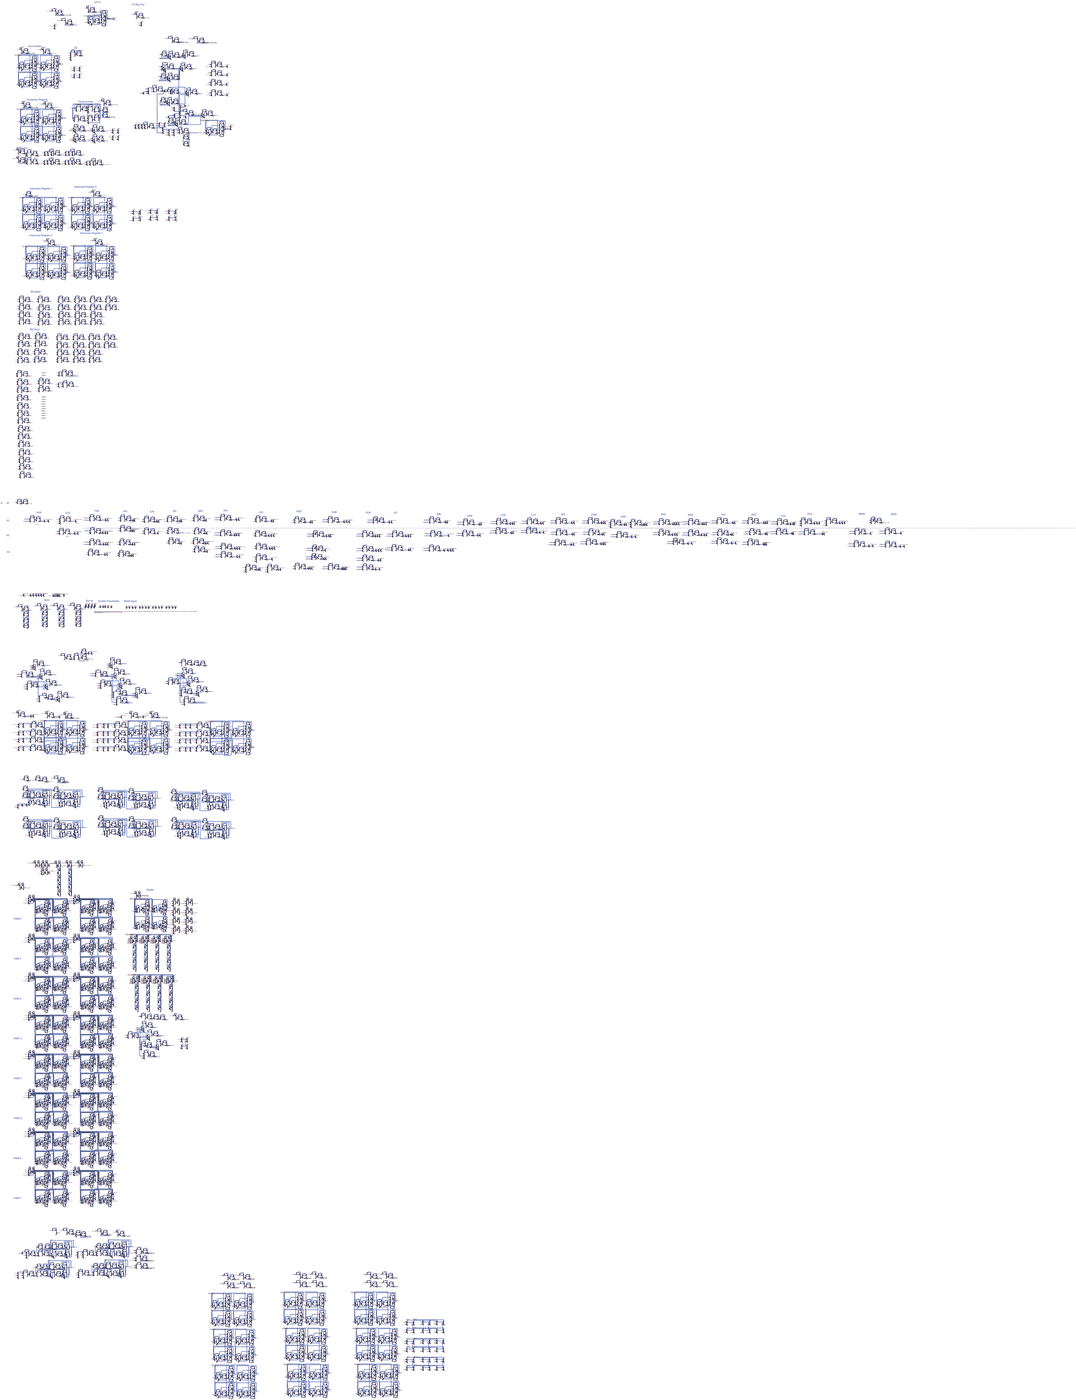
[diagram p0: schematic CPU.asc, whole sheet]
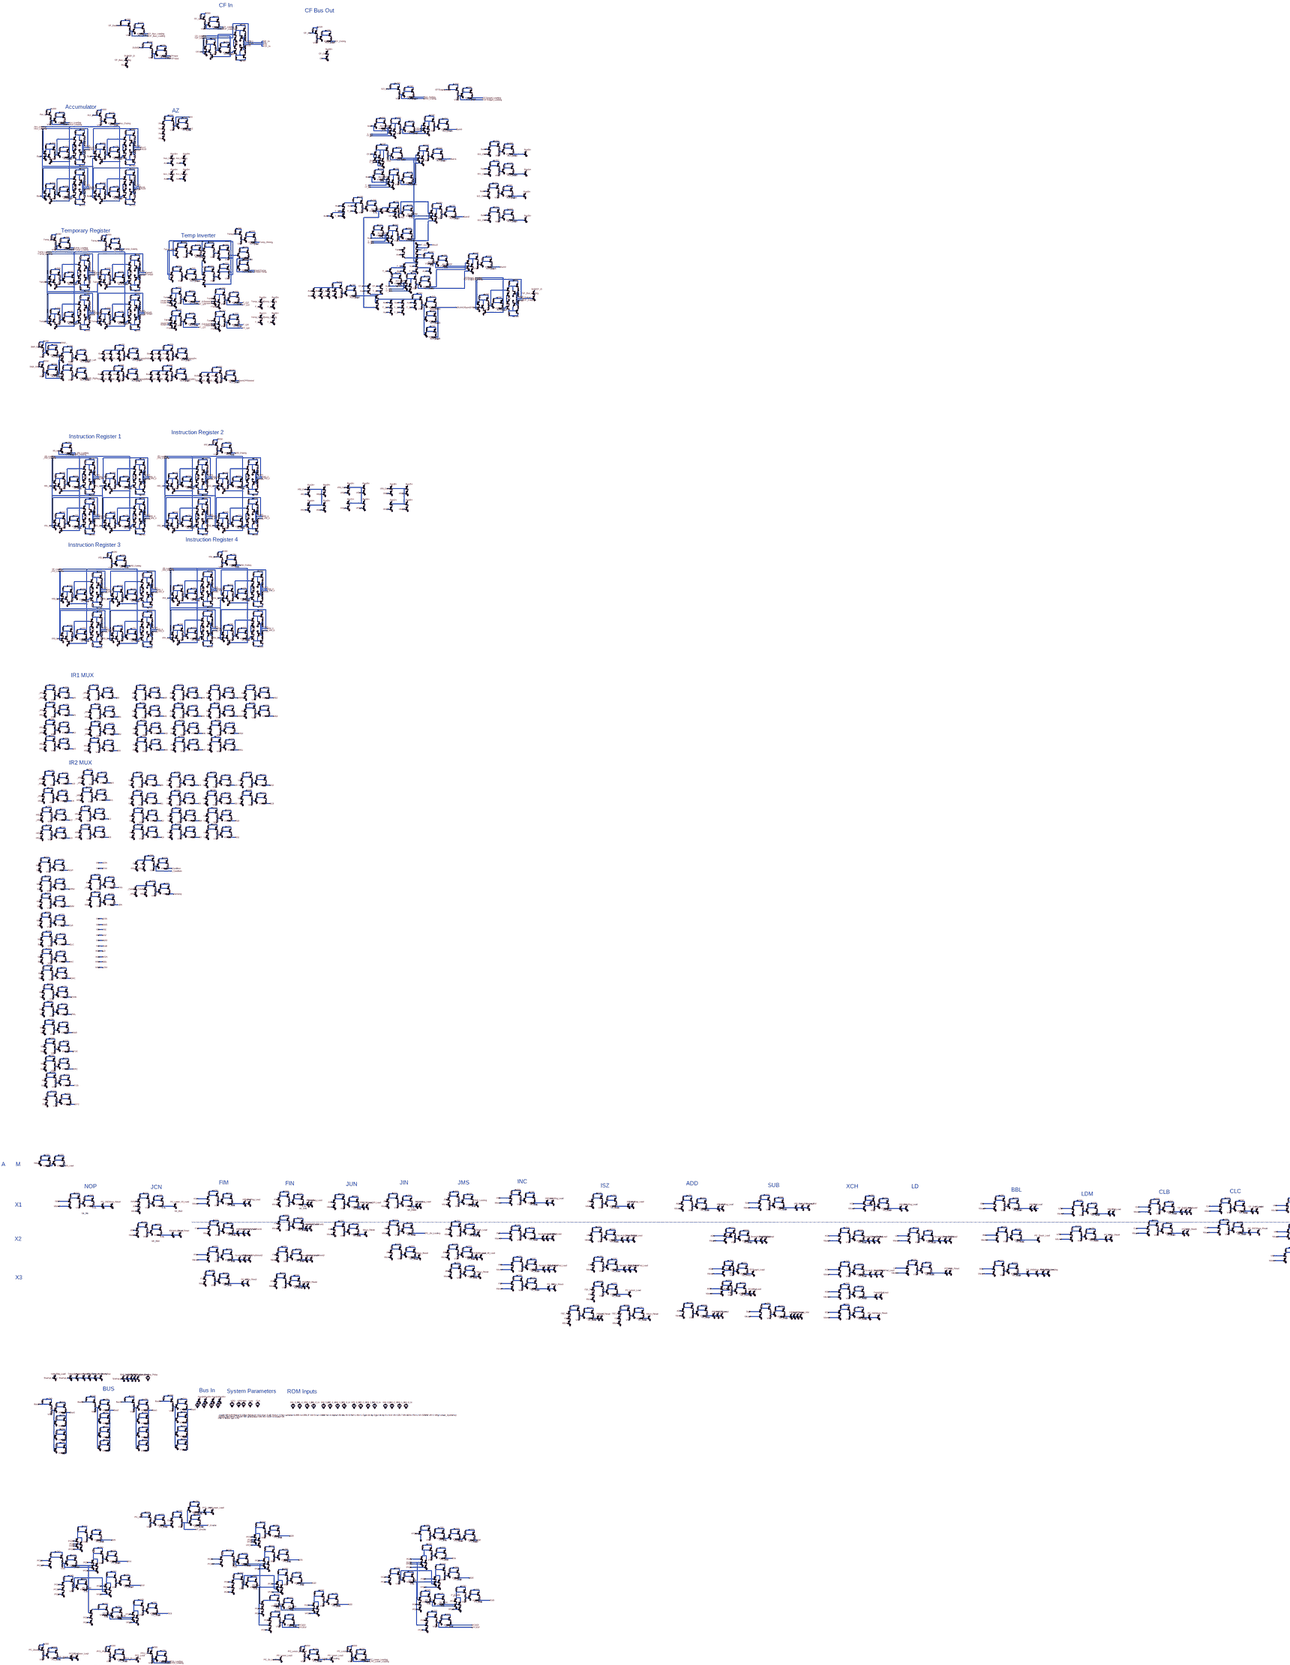
[diagram p1: schematic CPU.asc, part, row 1 of 2, column 1 of 2]
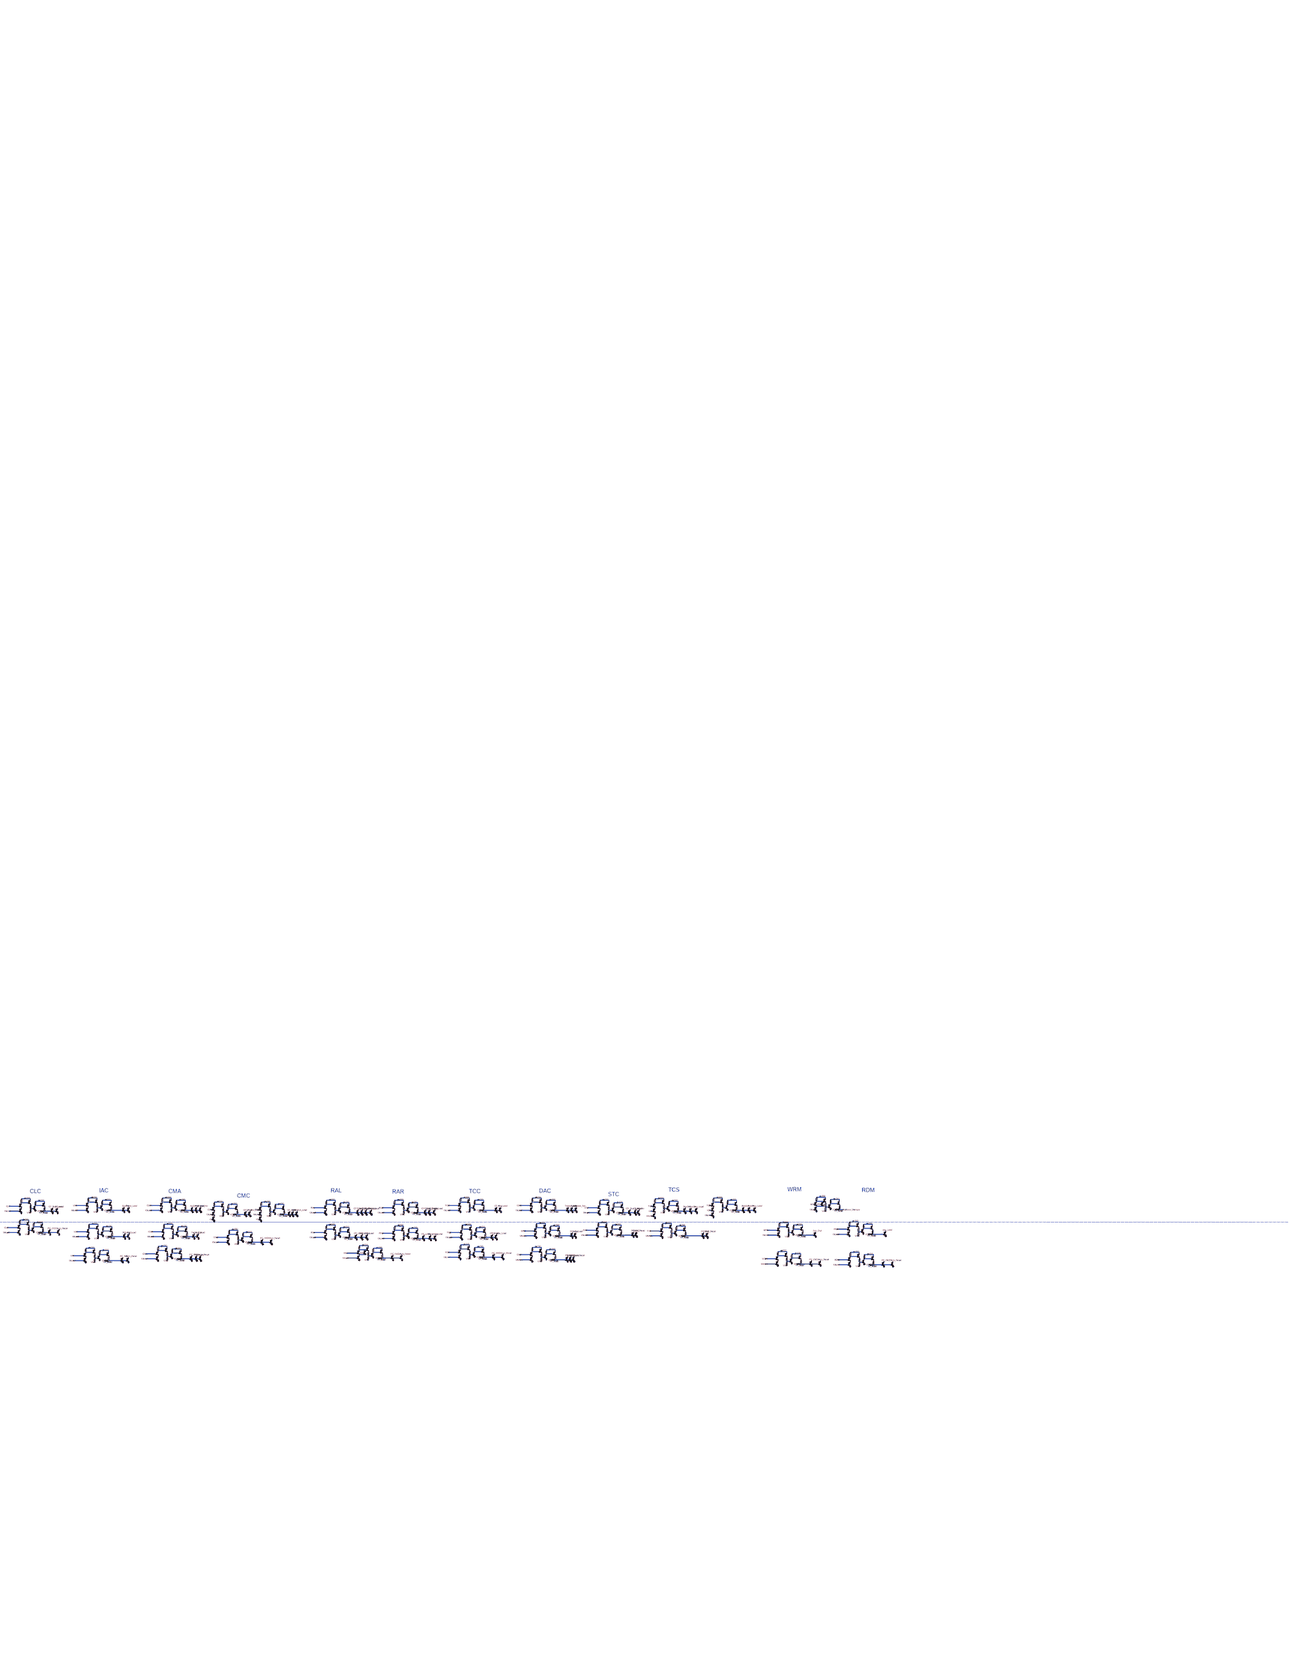
[diagram p2: schematic CPU.asc, part, row 1 of 2, column 2 of 2]
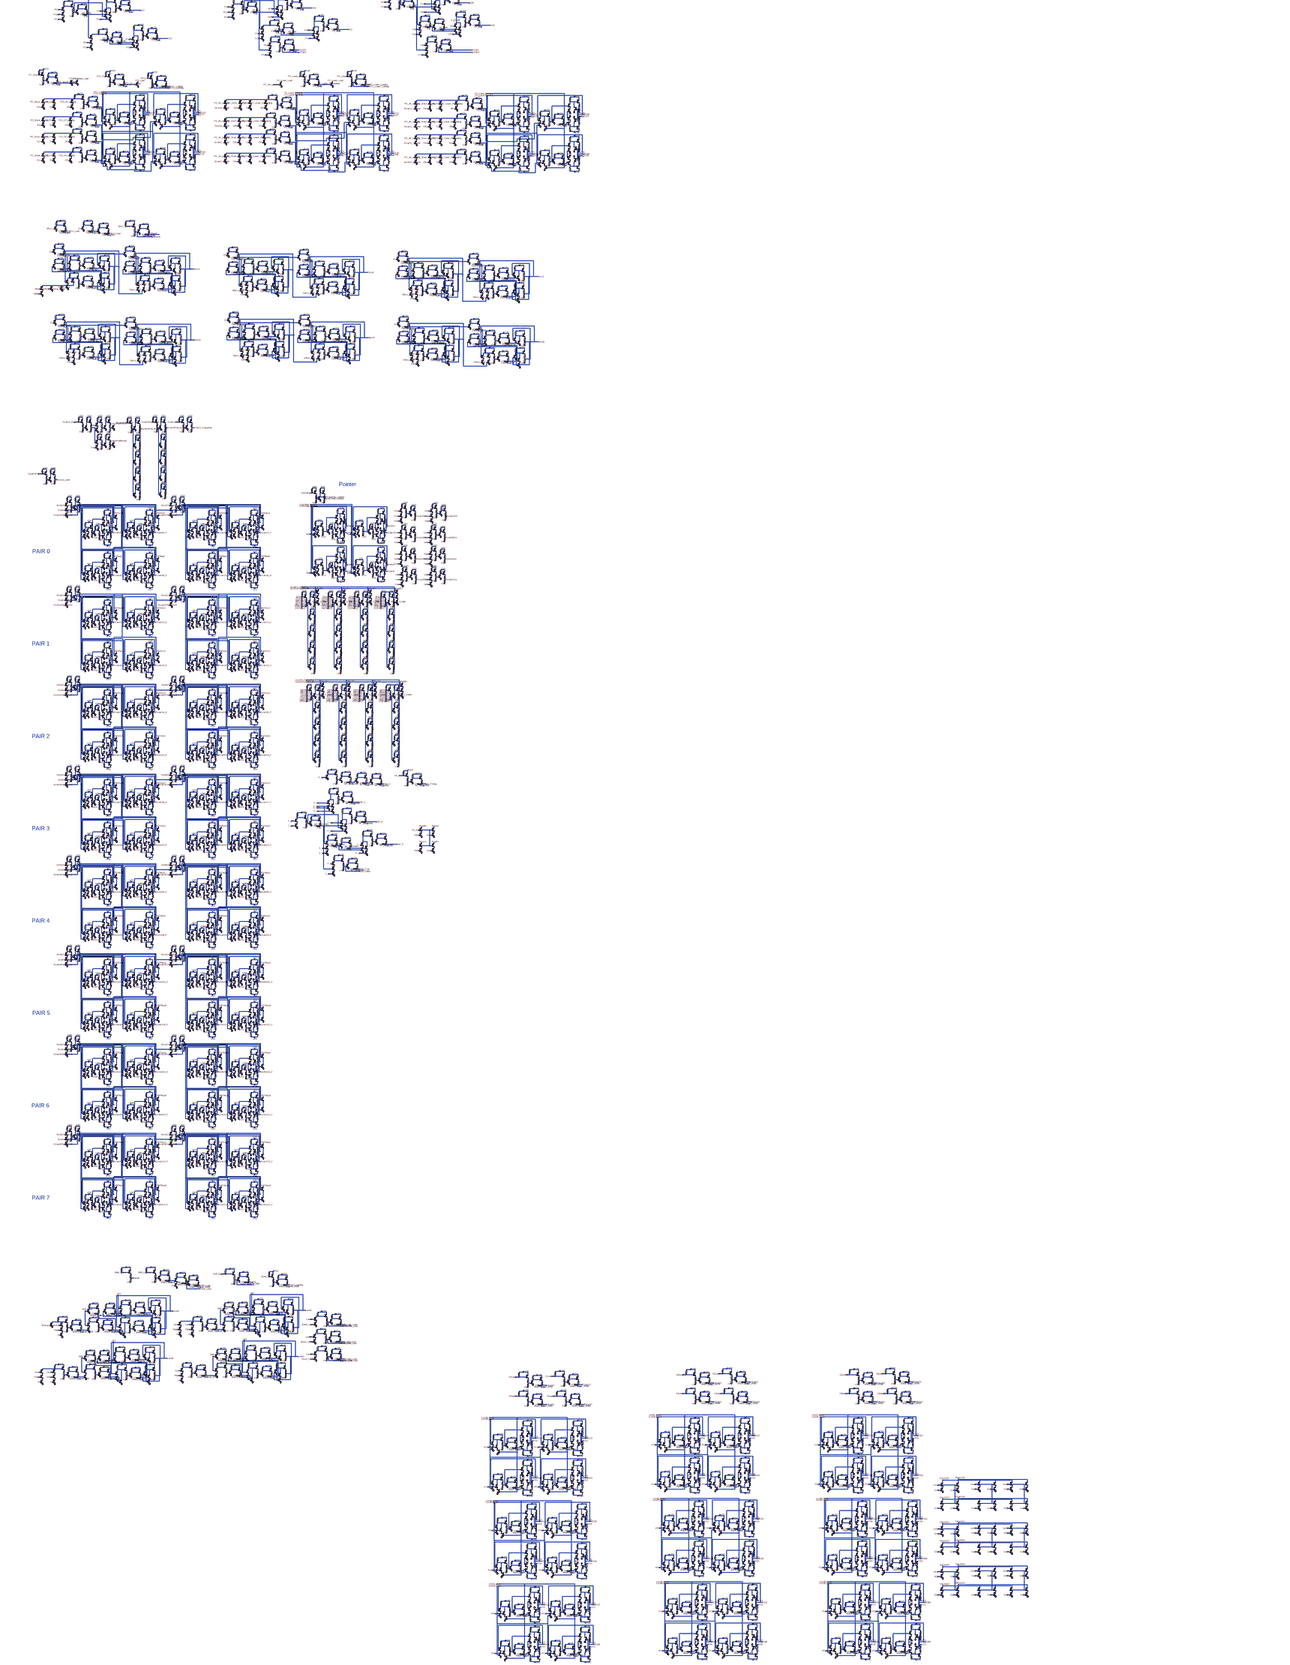
[diagram p3: schematic CPU.asc, part, row 2 of 2, column 1 of 2]
* CPU.asc
J§ALU_J1 N016 !Acc0 P001 DR
R§ALU_R1 VDD N016 100k
J§ALU_J2 VDD N016 P002 DR
R§ALU_R2 P002 AN 1k
R§ALU_R3 AN VSS 4.8k
J§ALU_J3 P001 !Acc1 P003 DR
J§ALU_J4 N019 AN 0 DR
R§ALU_R4 VDD N019 50k
J§ALU_J5 VDD N019 P004 DR
R§ALU_R5 P004 AZ 1k
R§ALU_R6 AZ VSS 4.53k
J§ALU_J6 P003 !Acc2 P005 DR
J§ALU_J7 P005 !Acc3 0 DR
J§ALU_J8 P006 T_Q3 0 DR
J§ALU_J9 Bus3In Temp_Outing P006 DR
J§ALU_J10 P007 T_Q2 0 DR
J§ALU_J11 Bus2In Temp_Outing P007 DR
J§ALU_J12 P008 T_Q1 0 DR
J§ALU_J13 Bus1In Temp_Outing P008 DR
J§ALU_J14 P009 T_Q0 0 DR
J§ALU_J15 Bus0In Temp_Outing P009 DR
R§ALU_R7 VDD Temp_INV 100k
J§ALU_J16 VDD Temp_INV P010 DR
R§ALU_R8 P010 N102 1k
R§ALU_R9 N102 VSS 4.8k
J§ALU_J17 N101 N102 0 DR
R§ALU_R10 VDD N101 50k
J§ALU_J18 VDD N101 P011 DR
R§ALU_R11 P011 Temp_INVing 1k
R§ALU_R12 Temp_INVing VSS 4.5k
J§ALU_J19 N157 Temp3 P012 DR
R§ALU_R13 VDD N157 100k
J§ALU_J20 VDD N157 P013 DR
R§ALU_R14 P013 !T_Q3 1k
R§ALU_R15 !T_Q3 VSS 4.8k
J§ALU_J21 N157 InvertTemp P014 DR
J§ALU_J22 N161 !T_Q3 0 DR
R§ALU_R16 VDD N161 50k
J§ALU_J23 VDD N161 P015 DR
R§ALU_R17 P015 T_Q3 1k
R§ALU_R18 T_Q3 VSS 4.5k
J§ALU_J24 P012 !InvertTemp 0 DR
J§ALU_J25 P014 !Temp3 0 DR
J§ALU_J26 N159 Temp2 P016 DR
R§ALU_R19 VDD N159 100k
J§ALU_J27 VDD N159 P017 DR
R§ALU_R20 P017 !T_Q2 1k
R§ALU_R21 !T_Q2 VSS 4.8k
J§ALU_J28 N159 InvertTemp P018 DR
J§ALU_J29 N163 !T_Q2 0 DR
R§ALU_R22 VDD N163 50k
J§ALU_J30 VDD N163 P019 DR
R§ALU_R23 P019 T_Q2 1k
R§ALU_R24 T_Q2 VSS 4.5k
J§ALU_J31 P016 !InvertTemp 0 DR
J§ALU_J32 P018 !Temp2 0 DR
J§ALU_J33 N177 Temp1 P020 DR
R§ALU_R25 VDD N177 100k
J§ALU_J34 VDD N177 P021 DR
R§ALU_R26 P021 !T_Q1 1k
R§ALU_R27 !T_Q1 VSS 4.8k
J§ALU_J35 N177 InvertTemp P022 DR
J§ALU_J36 N182 !T_Q1 0 DR
R§ALU_R28 VDD N182 50k
J§ALU_J37 VDD N182 P023 DR
R§ALU_R29 P023 T_Q1 1k
R§ALU_R30 T_Q1 VSS 4.5k
J§ALU_J38 P020 !InvertTemp 0 DR
J§ALU_J39 P022 !Temp1 0 DR
J§ALU_J40 N181 Temp0 P024 DR
R§ALU_R31 VDD N181 100k
J§ALU_J41 VDD N181 P025 DR
R§ALU_R32 P025 !T_Q0 1k
R§ALU_R33 !T_Q0 VSS 4.8k
J§ALU_J42 N181 InvertTemp P026 DR
J§ALU_J43 N183 !T_Q0 0 DR
R§ALU_R34 VDD N183 50k
J§ALU_J44 VDD N183 P027 DR
R§ALU_R35 P027 T_Q0 1k
R§ALU_R36 T_Q0 VSS 4.5k
J§ALU_J45 P024 !InvertTemp 0 DR
J§ALU_J46 P026 !Temp0 0 DR
R§ALU_R37 VDD Acc_Load 100k
J§ALU_J47 VDD Acc_Load P028 DR
R§ALU_R38 P028 !Acc_Loading 1k
R§ALU_R39 !Acc_Loading VSS 4.8k
J§ALU_J48 N014 !Acc_Loading 0 DR
R§ALU_R40 VDD N014 50k
J§ALU_J49 VDD N014 P029 DR
R§ALU_R41 P029 Acc_Loading 1k
R§ALU_R42 Acc_Loading VSS 4.5k
R§ALU_R43 VDD Acc_Out 100k
J§ALU_J50 VDD Acc_Out P030 DR
R§ALU_R44 P030 N017 1k
R§ALU_R45 N017 VSS 4.8k
J§ALU_J51 N015 N017 0 DR
R§ALU_R46 VDD N015 50k
J§ALU_J52 VDD N015 P031 DR
R§ALU_R47 P031 Acc_Outing 1k
R§ALU_R48 Acc_Outing VSS 4.5k
J§ALU_J53 N028 N030 P032 DR
R§ALU_R49 VDD N028 100k
J§ALU_J54 VDD N028 P033 DR
R§ALU_R50 P033 Acc3 1k
R§ALU_R51 Acc3 VSS 4.8k
J§ALU_J55 N028 !Acc3 0 DR
J§ALU_J56 N051 N045 P034 DR
R§ALU_R52 VDD N051 100k
J§ALU_J57 VDD N051 P035 DR
R§ALU_R53 P035 !Acc3 1k
R§ALU_R54 !Acc3 VSS 4.8k
J§ALU_J58 N051 Acc3 0 DR
J§ALU_J59 P032 CLK 0 DR
J§ALU_J60 P034 CLK 0 DR
J§ALU_J61 N034 Acc3 P036 DR
R§ALU_R55 VDD N034 100k
J§ALU_J62 VDD N034 P037 DR
R§ALU_R56 P037 N030 1k
R§ALU_R57 N030 VSS 4.8k
J§ALU_J63 N034 Bus3 P038 DR
J§ALU_J64 N038 N030 0 DR
R§ALU_R58 VDD N038 50k
J§ALU_J65 VDD N038 P039 DR
R§ALU_R59 P039 N045 1k
R§ALU_R60 N045 VSS 4.5k
J§ALU_J66 P036 !Acc_Loading 0 DR
J§ALU_J67 P038 Acc_Loading 0 DR
J§ALU_J68 N029 N031 P040 DR
R§ALU_R61 VDD N029 100k
J§ALU_J69 VDD N029 P041 DR
R§ALU_R62 P041 Acc2 1k
R§ALU_R63 Acc2 VSS 4.8k
J§ALU_J70 N029 !Acc2 0 DR
J§ALU_J71 N052 N046 P042 DR
R§ALU_R64 VDD N052 100k
J§ALU_J72 VDD N052 P043 DR
R§ALU_R65 P043 !Acc2 1k
R§ALU_R66 !Acc2 VSS 4.8k
J§ALU_J73 N052 Acc2 0 DR
J§ALU_J74 P040 CLK 0 DR
J§ALU_J75 P042 CLK 0 DR
J§ALU_J76 N035 Acc2 P044 DR
R§ALU_R67 VDD N035 100k
J§ALU_J77 VDD N035 P045 DR
R§ALU_R68 P045 N031 1k
R§ALU_R69 N031 VSS 4.8k
J§ALU_J78 N035 Bus2 P046 DR
J§ALU_J79 N039 N031 0 DR
R§ALU_R70 VDD N039 50k
J§ALU_J80 VDD N039 P047 DR
R§ALU_R71 P047 N046 1k
R§ALU_R72 N046 VSS 4.5k
J§ALU_J81 P044 !Acc_Loading 0 DR
J§ALU_J82 P046 Acc_Loading 0 DR
J§ALU_J83 N059 N063 P048 DR
R§ALU_R73 VDD N059 100k
J§ALU_J84 VDD N059 P049 DR
R§ALU_R74 P049 Acc1 1k
R§ALU_R75 Acc1 VSS 4.8k
J§ALU_J85 N059 !Acc1 0 DR
J§ALU_J86 N076 N073 P050 DR
R§ALU_R76 VDD N076 100k
J§ALU_J87 VDD N076 P051 DR
R§ALU_R77 P051 !Acc1 1k
R§ALU_R78 !Acc1 VSS 4.8k
J§ALU_J88 N076 Acc1 0 DR
J§ALU_J89 P048 CLK 0 DR
J§ALU_J90 P050 CLK 0 DR
J§ALU_J91 N067 Acc1 P052 DR
R§ALU_R79 VDD N067 100k
J§ALU_J92 VDD N067 P053 DR
R§ALU_R80 P053 N063 1k
R§ALU_R81 N063 VSS 4.8k
J§ALU_J93 N067 Bus1 P054 DR
J§ALU_J94 N070 N063 0 DR
R§ALU_R82 VDD N070 50k
J§ALU_J95 VDD N070 P055 DR
R§ALU_R83 P055 N073 1k
R§ALU_R84 N073 VSS 4.5k
J§ALU_J96 P052 !Acc_Loading 0 DR
J§ALU_J97 P054 Acc_Loading 0 DR
J§ALU_J98 N060 N064 P056 DR
R§ALU_R85 VDD N060 100k
J§ALU_J99 VDD N060 P057 DR
R§ALU_R86 P057 Acc0 1k
R§ALU_R87 Acc0 VSS 4.8k
J§ALU_J100 N060 !Acc0 0 DR
J§ALU_J101 N077 N074 P058 DR
R§ALU_R88 VDD N077 100k
J§ALU_J102 VDD N077 P059 DR
R§ALU_R89 P059 !Acc0 1k
R§ALU_R90 !Acc0 VSS 4.8k
J§ALU_J103 N077 Acc0 0 DR
J§ALU_J104 P056 CLK 0 DR
J§ALU_J105 P058 CLK 0 DR
J§ALU_J106 N068 Acc0 P060 DR
R§ALU_R91 VDD N068 100k
J§ALU_J107 VDD N068 P061 DR
R§ALU_R92 P061 N064 1k
R§ALU_R93 N064 VSS 4.8k
J§ALU_J108 N068 Bus0 P062 DR
J§ALU_J109 N071 N064 0 DR
R§ALU_R94 VDD N071 50k
J§ALU_J110 VDD N071 P063 DR
R§ALU_R95 P063 N074 1k
R§ALU_R96 N074 VSS 4.5k
J§ALU_J111 P060 !Acc_Loading 0 DR
J§ALU_J112 P062 Acc_Loading 0 DR
R§ALU_R97 VDD CF_Load 100k
J§ALU_J113 VDD CF_Load P064 DR
R§ALU_R98 P064 !CF_Loading 1k
R§ALU_R99 !CF_Loading VSS 4.8k
J§ALU_J114 N001 !CF_Loading 0 DR
R§ALU_R100 VDD N001 50k
J§ALU_J115 VDD N001 P065 DR
R§ALU_R101 P065 CF_Loading 1k
R§ALU_R102 CF_Loading VSS 4.5k
R§ALU_R103 VDD CF_Out 100k
J§ALU_J116 VDD CF_Out P066 DR
R§ALU_R104 P066 N006 1k
R§ALU_R105 N006 VSS 4.8k
J§ALU_J117 N005 N006 0 DR
R§ALU_R106 VDD N005 50k
J§ALU_J118 VDD N005 P067 DR
R§ALU_R107 P067 CF_Outing 1k
R§ALU_R108 CF_Outing VSS 4.5k
J§ALU_J119 N003 N004 P068 DR
R§ALU_R109 VDD N003 100k
J§ALU_J120 VDD N003 P069 DR
R§ALU_R110 P069 CF0 1k
R§ALU_R111 CF0 VSS 4.8k
J§ALU_J121 N003 !CF 0 DR
J§ALU_J122 N011 N010 P070 DR
R§ALU_R112 VDD N011 100k
J§ALU_J123 VDD N011 P071 DR
R§ALU_R113 P071 !CF 1k
R§ALU_R114 !CF VSS 4.8k
J§ALU_J124 N011 CF0 0 DR
J§ALU_J125 P068 CLK 0 DR
J§ALU_J126 P070 CLK 0 DR
J§ALU_J127 N007 CF0 P072 DR
R§ALU_R115 VDD N007 100k
J§ALU_J128 VDD N007 P073 DR
R§ALU_R116 P073 N004 1k
R§ALU_R117 N004 VSS 4.8k
J§ALU_J129 N007 CFInput P074 DR
J§ALU_J130 N008 N004 0 DR
R§ALU_R118 VDD N008 50k
J§ALU_J131 VDD N008 P075 DR
R§ALU_R119 P075 N010 1k
R§ALU_R120 N010 VSS 4.5k
J§ALU_J132 P072 !CF_Loading 0 DR
J§ALU_J133 P074 CF_Loading 0 DR
J§ALU_J134 P076 CF0 0 DR
J§ALU_J135 Bus0In CF_Outing P076 DR
R§ALU_R121 VDD Temp_Load 100k
J§ALU_J136 VDD Temp_Load P077 DR
R§ALU_R122 P077 !Temp_Loading 1k
R§ALU_R123 !Temp_Loading VSS 4.8k
J§ALU_J137 N105 !Temp_Loading 0 DR
R§ALU_R124 VDD N105 50k
J§ALU_J138 VDD N105 P078 DR
R§ALU_R125 P078 Temp_Loading 1k
R§ALU_R126 Temp_Loading VSS 4.5k
R§ALU_R127 VDD Temp_Out 100k
J§ALU_J139 VDD Temp_Out P079 DR
R§ALU_R128 P079 N107 1k
R§ALU_R129 N107 VSS 4.8k
J§ALU_J140 N106 N107 0 DR
R§ALU_R130 VDD N106 50k
J§ALU_J141 VDD N106 P080 DR
R§ALU_R131 P080 Temp_Outing 1k
R§ALU_R132 Temp_Outing VSS 4.5k
J§ALU_J142 N119 N126 P081 DR
R§ALU_R133 VDD N119 100k
J§ALU_J143 VDD N119 P082 DR
R§ALU_R134 P082 Temp3 1k
R§ALU_R135 Temp3 VSS 4.8k
J§ALU_J144 N119 !Temp3 0 DR
J§ALU_J145 N151 N147 P083 DR
R§ALU_R136 VDD N151 100k
J§ALU_J146 VDD N151 P084 DR
R§ALU_R137 P084 !Temp3 1k
R§ALU_R138 !Temp3 VSS 4.8k
J§ALU_J147 N151 Temp3 0 DR
J§ALU_J148 P081 CLK 0 DR
J§ALU_J149 P083 CLK 0 DR
J§ALU_J150 N138 Temp3 P085 DR
R§ALU_R139 VDD N138 100k
J§ALU_J151 VDD N138 P086 DR
R§ALU_R140 P086 N126 1k
R§ALU_R141 N126 VSS 4.8k
J§ALU_J152 N138 Temp3In P087 DR
J§ALU_J153 N140 N126 0 DR
R§ALU_R142 VDD N140 50k
J§ALU_J154 VDD N140 P088 DR
R§ALU_R143 P088 N147 1k
R§ALU_R144 N147 VSS 4.5k
J§ALU_J155 P085 !Temp_Loading 0 DR
J§ALU_J156 P087 Temp_Loading 0 DR
J§ALU_J157 N120 N127 P089 DR
R§ALU_R145 VDD N120 100k
J§ALU_J158 VDD N120 P090 DR
R§ALU_R146 P090 Temp2 1k
R§ALU_R147 Temp2 VSS 4.8k
J§ALU_J159 N120 !Temp2 0 DR
J§ALU_J160 N152 N148 P091 DR
R§ALU_R148 VDD N152 100k
J§ALU_J161 VDD N152 P092 DR
R§ALU_R149 P092 !Temp2 1k
R§ALU_R150 !Temp2 VSS 4.8k
J§ALU_J162 N152 Temp2 0 DR
J§ALU_J163 P089 CLK 0 DR
J§ALU_J164 P091 CLK 0 DR
J§ALU_J165 N139 Temp2 P093 DR
R§ALU_R151 VDD N139 100k
J§ALU_J166 VDD N139 P094 DR
R§ALU_R152 P094 N127 1k
R§ALU_R153 N127 VSS 4.8k
J§ALU_J167 N139 Temp2In P095 DR
J§ALU_J168 N141 N127 0 DR
R§ALU_R154 VDD N141 50k
J§ALU_J169 VDD N141 P096 DR
R§ALU_R155 P096 N148 1k
R§ALU_R156 N148 VSS 4.5k
J§ALU_J170 P093 !Temp_Loading 0 DR
J§ALU_J171 P095 Temp_Loading 0 DR
J§ALU_J172 N165 N170 P097 DR
R§ALU_R157 VDD N165 100k
J§ALU_J173 VDD N165 P098 DR
R§ALU_R158 P098 Temp1 1k
R§ALU_R159 Temp1 VSS 4.8k
J§ALU_J174 N165 !Temp1 0 DR
J§ALU_J175 N186 N184 P099 DR
R§ALU_R160 VDD N186 100k
J§ALU_J176 VDD N186 P100 DR
R§ALU_R161 P100 !Temp1 1k
R§ALU_R162 !Temp1 VSS 4.8k
J§ALU_J177 N186 Temp1 0 DR
J§ALU_J178 P097 CLK 0 DR
J§ALU_J179 P099 CLK 0 DR
J§ALU_J180 N175 Temp1 P101 DR
R§ALU_R163 VDD N175 100k
J§ALU_J181 VDD N175 P102 DR
R§ALU_R164 P102 N170 1k
R§ALU_R165 N170 VSS 4.8k
J§ALU_J182 N175 Temp1In P103 DR
J§ALU_J183 N179 N170 0 DR
R§ALU_R166 VDD N179 50k
J§ALU_J184 VDD N179 P104 DR
R§ALU_R167 P104 N184 1k
R§ALU_R168 N184 VSS 4.5k
J§ALU_J185 P101 !Temp_Loading 0 DR
J§ALU_J186 P103 Temp_Loading 0 DR
J§ALU_J187 N166 N171 P105 DR
R§ALU_R169 VDD N166 100k
J§ALU_J188 VDD N166 P106 DR
R§ALU_R170 P106 Temp0 1k
R§ALU_R171 Temp0 VSS 4.8k
J§ALU_J189 N166 !Temp0 0 DR
J§ALU_J190 N187 N185 P107 DR
R§ALU_R172 VDD N187 100k
J§ALU_J191 VDD N187 P108 DR
R§ALU_R173 P108 !Temp0 1k
R§ALU_R174 !Temp0 VSS 4.8k
J§ALU_J192 N187 Temp0 0 DR
J§ALU_J193 P105 CLK 0 DR
J§ALU_J194 P107 CLK 0 DR
J§ALU_J195 N176 Temp0 P109 DR
R§ALU_R175 VDD N176 100k
J§ALU_J196 VDD N176 P110 DR
R§ALU_R176 P110 N171 1k
R§ALU_R177 N171 VSS 4.8k
J§ALU_J197 N176 Temp0In P111 DR
J§ALU_J198 N180 N171 0 DR
R§ALU_R178 VDD N180 50k
J§ALU_J199 VDD N180 P112 DR
R§ALU_R179 P112 N185 1k
R§ALU_R180 N185 VSS 4.5k
J§ALU_J200 P109 !Temp_Loading 0 DR
J§ALU_J201 P111 Temp_Loading 0 DR
J§ALU_J202 N081 Acc1 N089 DR
J§ALU_J203 N020 Acc0 0 DR
R§ALU_R181 VDD N020 50k
J§ALU_J204 VDD N020 P113 DR
R§ALU_R182 P113 N026 1k
R§ALU_R183 N026 VSS 4.5k
J§ALU_J205 N021 T_Q0 P114 DR
R§ALU_R184 VDD N021 100k
J§ALU_J206 VDD N021 P115 DR
R§ALU_R185 P115 N027 1k
R§ALU_R186 N027 VSS 4.8k
J§ALU_J207 N021 Acc0 P116 DR
J§ALU_J208 N024 N027 0 DR
R§ALU_R187 VDD N024 50k
J§ALU_J209 VDD N024 P117 DR
R§ALU_R188 P117 N023 1k
R§ALU_R189 N023 VSS 4.5k
J§ALU_J210 P114 N026 0 DR
J§ALU_J211 P116 !T_Q0 0 DR
J§ALU_J212 N018 N023 P118 DR
R§ALU_R190 VDD N018 100k
J§ALU_J213 VDD N018 P119 DR
R§ALU_R191 P119 N025 1k
R§ALU_R192 N025 VSS 4.8k
J§ALU_J214 N018 CF0 P120 DR
J§ALU_J215 N022 N025 0 DR
R§ALU_R193 VDD N022 50k
J§ALU_J216 VDD N022 P121 DR
R§ALU_R194 P121 Sum0 1k
R§ALU_R195 Sum0 VSS 4.5k
J§ALU_J217 P118 !CF 0 DR
J§ALU_J218 P120 N027 0 DR
J§ALU_J219 N036 CF0 N048 DR
R§ALU_R196 VDD N036 100k
J§ALU_J220 VDD N036 P122 DR
R§ALU_R197 P122 N047 1k
R§ALU_R198 N047 VSS 4.8k
J§ALU_J221 N036 CF0 P123 DR
J§ALU_J222 N041 N047 0 DR
R§ALU_R199 VDD N041 50k
J§ALU_J223 VDD N041 P124 DR
R§ALU_R200 P124 N050 1k
R§ALU_R201 N050 VSS 4.5k
J§ALU_J224 N048 Acc0 0 DR
J§ALU_J225 P123 T_Q0 0 DR
J§ALU_J226 N036 Acc0 P125 DR
J§ALU_J227 P125 T_Q0 0 DR
J§ALU_J228 N037 N044 P126 DR
R§ALU_R202 VDD N037 100k
J§ALU_J229 VDD N037 P127 DR
R§ALU_R203 P127 N049 1k
R§ALU_R204 N049 VSS 4.8k
J§ALU_J230 N037 N050 P128 DR
J§ALU_J231 N042 N049 0 DR
R§ALU_R205 VDD N042 50k
J§ALU_J232 VDD N042 P129 DR
R§ALU_R206 P129 Sum1 1k
R§ALU_R207 Sum1 VSS 4.5k
J§ALU_J233 P126 N047 0 DR
J§ALU_J234 P128 N053 0 DR
J§ALU_J235 N057 Acc1 0 DR
R§ALU_R208 VDD N057 50k
J§ALU_J236 VDD N057 P130 DR
R§ALU_R209 P130 N065 1k
R§ALU_R210 N065 VSS 4.5k
J§ALU_J237 N061 T_Q1 P131 DR
R§ALU_R211 VDD N061 100k
J§ALU_J238 VDD N061 P132 DR
R§ALU_R212 P132 N053 1k
R§ALU_R213 N053 VSS 4.8k
J§ALU_J239 N061 Acc1 P133 DR
J§ALU_J240 N062 N053 0 DR
R§ALU_R214 VDD N062 50k
J§ALU_J241 VDD N062 P134 DR
R§ALU_R215 P134 N044 1k
R§ALU_R216 N044 VSS 4.5k
J§ALU_J242 P131 N065 0 DR
J§ALU_J243 P133 !T_Q1 0 DR
J§ALU_J244 N081 T_Q1 N089 DR
J§ALU_J245 N083 N090 P135 DR
R§ALU_R217 VDD N083 100k
J§ALU_J246 VDD N083 P136 DR
R§ALU_R218 P136 N091 1k
R§ALU_R219 N091 VSS 4.8k
J§ALU_J247 N083 N093 P137 DR
J§ALU_J248 N086 N091 0 DR
R§ALU_R220 VDD N086 50k
J§ALU_J249 VDD N086 P138 DR
R§ALU_R221 P138 Sum2 1k
R§ALU_R222 Sum2 VSS 4.5k
J§ALU_J250 P135 N078 0 DR
J§ALU_J251 P137 N096 0 DR
J§ALU_J252 N097 Acc2 0 DR
R§ALU_R223 VDD N097 50k
J§ALU_J253 VDD N097 P139 DR
R§ALU_R224 P139 N100 1k
R§ALU_R225 N100 VSS 4.5k
J§ALU_J254 N098 T_Q2 P140 DR
R§ALU_R226 VDD N098 100k
J§ALU_J255 VDD N098 P141 DR
R§ALU_R227 P141 N096 1k
R§ALU_R228 N096 VSS 4.8k
J§ALU_J256 N098 Acc2 P142 DR
J§ALU_J257 N099 N096 0 DR
R§ALU_R229 VDD N099 50k
J§ALU_J258 VDD N099 P143 DR
R§ALU_R230 P143 N090 1k
R§ALU_R231 N090 VSS 4.5k
J§ALU_J259 P140 N100 0 DR
J§ALU_J260 P142 !T_Q2 0 DR
R§ALU_R232 VDD N117 100k
J§ALU_J261 VDD N117 P144 DR
R§ALU_R233 P144 N125 1k
R§ALU_R234 N125 VSS 4.8k
J§ALU_J262 N121 N125 0 DR
R§ALU_R235 VDD N121 50k
J§ALU_J263 VDD N121 P145 DR
R§ALU_R236 P145 N130 1k
R§ALU_R237 N130 VSS 4.5k
J§ALU_J264 N117 Acc2 P146 DR
J§ALU_J265 P146 Temp2 0 DR
J§ALU_J266 N117 Acc1 P147 DR
J§ALU_J267 P147 T_Q1 N110 DR
J§ALU_J268 N110 T_Q2 0 DR
J§ALU_J269 N110 Acc2 0 DR
J§ALU_J270 N132 Acc1 0 DR
J§ALU_J271 N123 T_Q2 N131 DR
J§ALU_J272 N131 Acc1 0 DR
J§ALU_J273 N132 T_Q1 0 DR
J§ALU_J274 N123 Acc2 N132 DR
J§ALU_J275 N131 T_Q1 0 DR
J§ALU_J276 N117 N050 N123 DR
J§ALU_J277 N118 N124 P148 DR
R§ALU_R238 VDD N118 100k
J§ALU_J278 VDD N118 P149 DR
R§ALU_R239 P149 N129 1k
R§ALU_R240 N129 VSS 4.8k
J§ALU_J279 N118 N130 P150 DR
J§ALU_J280 N122 N129 0 DR
R§ALU_R241 VDD N122 50k
J§ALU_J281 VDD N122 P151 DR
R§ALU_R242 P151 Sum3 1k
R§ALU_R243 Sum3 VSS 4.5k
J§ALU_J282 P148 N125 0 DR
J§ALU_J283 P150 N136 0 DR
J§ALU_J284 N144 Acc3 0 DR
R§ALU_R244 VDD N144 50k
J§ALU_J285 VDD N144 P152 DR
R§ALU_R245 P152 N150 1k
R§ALU_R246 N150 VSS 4.5k
J§ALU_J286 N145 T_Q3 P153 DR
R§ALU_R247 VDD N145 100k
J§ALU_J287 VDD N145 P154 DR
R§ALU_R248 P154 N136 1k
R§ALU_R249 N136 VSS 4.8k
J§ALU_J288 N145 Acc3 P155 DR
J§ALU_J289 N149 N136 0 DR
R§ALU_R250 VDD N149 50k
J§ALU_J290 VDD N149 P156 DR
R§ALU_R251 P156 N124 1k
R§ALU_R252 N124 VSS 4.5k
J§ALU_J291 P153 N150 0 DR
J§ALU_J292 P155 !T_Q3 0 DR
R§ALU_R253 VDD N081 100k
J§ALU_J293 VDD N081 P157 DR
R§ALU_R254 P157 N078 1k
R§ALU_R255 N078 VSS 4.8k
J§ALU_J294 N084 N078 0 DR
R§ALU_R256 VDD N084 50k
J§ALU_J295 VDD N084 P158 DR
R§ALU_R257 P158 N093 1k
R§ALU_R258 N093 VSS 4.5k
J§ALU_J296 N079 Acc1 P159 DR
J§ALU_J297 P159 T_Q1 0 DR
J§ALU_J298 N079 Acc0 P160 DR
J§ALU_J299 P160 T_Q0 N088 DR
R§ALU_R259 VDD N079 100k
J§ALU_J300 VDD N079 P161 DR
R§ALU_R260 P161 N082 1k
R§ALU_R261 N082 VSS 4.8k
J§ALU_J301 N080 N082 0 DR
R§ALU_R262 VDD N080 50k
J§ALU_J302 VDD N080 P162 DR
R§ALU_R263 P162 N085 1k
R§ALU_R264 N085 VSS 4.5k
J§ALU_J303 N088 Acc1 0 DR
J§ALU_J304 N088 T_Q1 0 DR
J§ALU_J305 N089 CF0 0 DR
J§ALU_J306 N081 N085 0 DR
J§ALU_J307 N164 N162 P163 DR
J§ALU_J308 P163 N085 0 DR
J§ALU_J309 N160 T_Q1 P164 DR
J§ALU_J310 P164 CF0 0 DR
J§ALU_J311 N160 Acc1 P165 DR
J§ALU_J312 P165 CF0 0 DR
R§ALU_R265 VDD N154 100k
J§ALU_J313 VDD N154 P166 DR
R§ALU_R266 P166 N158 1k
R§ALU_R267 N158 VSS 4.8k
J§ALU_J314 N155 N158 0 DR
R§ALU_R268 VDD N155 50k
J§ALU_J315 VDD N155 P167 DR
R§ALU_R269 P167 N162 1k
R§ALU_R270 N162 VSS 4.5k
J§ALU_J316 N154 Acc3 P168 DR
J§ALU_J317 N154 T_Q3 P169 DR
J§ALU_J318 P168 T_Q2 0 DR
J§ALU_J319 P169 T_Q2 0 DR
J§ALU_J320 N164 Acc3 P170 DR
J§ALU_J321 P170 T_Q3 0 DR
J§ALU_J322 N164 Acc2 P171 DR
J§ALU_J323 P171 T_Q2 P172 DR
J§ALU_J324 P172 T_Q3 0 DR
J§ALU_J325 N164 Acc2 P173 DR
J§ALU_J326 P173 T_Q2 P174 DR
J§ALU_J327 P174 Acc3 0 DR
J§ALU_J328 N164 N162 N160 DR
R§ALU_R271 VDD N164 100k
J§ALU_J329 VDD N164 P175 DR
R§ALU_R272 P175 N172 1k
R§ALU_R273 N172 VSS 4.8k
J§ALU_J330 N168 N172 0 DR
R§ALU_R274 VDD N168 50k
J§ALU_J331 VDD N168 P176 DR
R§ALU_R275 P176 SUMCF 1k
R§ALU_R276 SUMCF VSS 4.5k
J§ALU_J332 N032 Sum0 P177 DR
R§ALU_R277 VDD N032 100k
J§ALU_J333 VDD N032 P178 DR
R§ALU_R278 P178 N040 1k
R§ALU_R279 N040 VSS 4.8k
J§ALU_J334 P177 EO_Outing 0 DR
J§ALU_J335 N033 N040 0 DR
R§ALU_R280 VDD N033 50k
J§ALU_J336 VDD N033 P179 DR
R§ALU_R281 P179 N043 1k
R§ALU_R282 N043 VSS 4.5k
J§ALU_J337 Bus0In N043 0 DR
J§ALU_J338 N054 Sum1 P180 DR
R§ALU_R283 VDD N054 100k
J§ALU_J339 VDD N054 P181 DR
R§ALU_R284 P181 N056 1k
R§ALU_R285 N056 VSS 4.8k
J§ALU_J340 P180 EO_Outing 0 DR
J§ALU_J341 N055 N056 0 DR
R§ALU_R286 VDD N055 50k
J§ALU_J342 VDD N055 P182 DR
R§ALU_R287 P182 N058 1k
R§ALU_R288 N058 VSS 4.5k
J§ALU_J343 Bus1In N058 0 DR
J§ALU_J344 N066 Sum2 P183 DR
R§ALU_R289 VDD N066 100k
J§ALU_J345 VDD N066 P184 DR
R§ALU_R290 P184 N072 1k
R§ALU_R291 N072 VSS 4.8k
J§ALU_J346 P183 EO_Outing 0 DR
J§ALU_J347 N069 N072 0 DR
R§ALU_R292 VDD N069 50k
J§ALU_J348 VDD N069 P185 DR
R§ALU_R293 P185 N075 1k
R§ALU_R294 N075 VSS 4.5k
J§ALU_J349 Bus2In N075 0 DR
J§ALU_J350 N087 Sum3 P186 DR
R§ALU_R295 VDD N087 100k
J§ALU_J351 VDD N087 P187 DR
R§ALU_R296 P187 N094 1k
R§ALU_R297 N094 VSS 4.8k
J§ALU_J352 P186 EO_Outing 0 DR
J§ALU_J353 N092 N094 0 DR
R§ALU_R298 VDD N092 50k
J§ALU_J354 VDD N092 P188 DR
R§ALU_R299 P188 N095 1k
R§ALU_R300 N095 VSS 4.5k
J§ALU_J355 Bus3In N095 0 DR
J§ALU_J356 N153 N156 P189 DR
R§ALU_R301 VDD N153 100k
J§ALU_J357 VDD N153 P190 DR
R§ALU_R302 P190 CF_Output 1k
R§ALU_R303 CF_Output VSS 4.8k
J§ALU_J358 N153 !CF_Output 0 DR
J§ALU_J359 N174 N173 P191 DR
R§ALU_R304 VDD N174 100k
J§ALU_J360 VDD N174 P192 DR
R§ALU_R305 P192 !CF_Output 1k
R§ALU_R306 !CF_Output VSS 4.8k
J§ALU_J361 N174 CF_Output 0 DR
J§ALU_J362 P189 CLK 0 DR
J§ALU_J363 P191 CLK 0 DR
J§ALU_J364 N167 CF_Output P193 DR
R§ALU_R307 VDD N167 100k
J§ALU_J365 VDD N167 P194 DR
R§ALU_R308 P194 N156 1k
R§ALU_R309 N156 VSS 4.8k
J§ALU_J366 N167 SumCFRotated P195 DR
J§ALU_J367 N169 N156 0 DR
R§ALU_R310 VDD N169 50k
J§ALU_J368 VDD N169 P196 DR
R§ALU_R311 P196 N173 1k
R§ALU_R312 N173 VSS 4.5k
J§ALU_J369 P193 !CFStage1_Loading 0 DR
J§ALU_J370 P195 CFStage1_Loading 0 DR
R§ALU_R313 VDD CF_Bus_Load 100k
J§ALU_J371 VDD CF_Bus_Load P197 DR
R§ALU_R314 P197 !CF_Bus_Loading 1k
R§ALU_R315 !CF_Bus_Loading VSS 4.8k
J§ALU_J372 N002 !CF_Bus_Loading 0 DR
R§ALU_R316 VDD N002 50k
J§ALU_J373 VDD N002 P198 DR
R§ALU_R317 P198 CF_Bus_Loading 1k
R§ALU_R318 CF_Bus_Loading VSS 4.5k
J§ALU_J374 P199 CF_Output 0 DR
J§ALU_J375 SUMCF_O !CF_Bus_Loading P199 DR
J§ALU_J376 SUMCF_O CF_Bus_Loading P200 DR
J§ALU_J377 P200 Bus0 0 DR
R§ALU_R319 VDD SUMCF_O 100k
J§ALU_J378 VDD SUMCF_O P201 DR
R§ALU_R320 P201 !CFInput 1k
R§ALU_R321 !CFInput VSS 4.8k
J§ALU_J379 N009 !CFInput 0 DR
R§ALU_R322 VDD N009 50k
J§ALU_J380 VDD N009 P202 DR
R§ALU_R323 P202 CFInput 1k
R§ALU_R324 CFInput VSS 4.5k
J§ALU_J381 P203 Acc3 0 DR
J§ALU_J382 Bus3In Acc_Outing P203 DR
J§ALU_J383 P204 Acc2 0 DR
J§ALU_J384 Bus2In Acc_Outing P204 DR
J§ALU_J385 P205 Acc1 0 DR
J§ALU_J386 Bus1In Acc_Outing P205 DR
J§ALU_J387 P206 Acc0 0 DR
J§ALU_J388 Bus0In Acc_Outing P206 DR
J§ALU_J389 N108 Temp_INVing P207 DR
R§ALU_R325 VDD N108 100k
J§ALU_J390 VDD N108 P208 DR
R§ALU_R326 P208 N114 1k
R§ALU_R327 N114 VSS 4.8k
J§ALU_J391 P207 N104 0 DR
J§ALU_J392 N111 N114 0 DR
R§ALU_R328 VDD N111 50k
J§ALU_J393 VDD N111 P209 DR
R§ALU_R329 P209 N116 1k
R§ALU_R330 N116 VSS 4.5k
J§ALU_J394 N134 Temp_INVing P210 DR
R§ALU_R331 VDD N134 100k
J§ALU_J395 VDD N134 P211 DR
R§ALU_R332 P211 N142 1k
R§ALU_R333 N142 VSS 4.8k
J§ALU_J396 P210 N103 0 DR
J§ALU_J397 N137 N142 0 DR
R§ALU_R334 VDD N137 50k
J§ALU_J398 VDD N137 P212 DR
R§ALU_R335 P212 N146 1k
R§ALU_R336 N146 VSS 4.5k
J§ALU_J399 N109 N104 P213 DR
R§ALU_R337 VDD N109 100k
J§ALU_J400 VDD N109 P214 DR
R§ALU_R338 P214 N115 1k
R§ALU_R339 N115 VSS 4.8k
J§ALU_J401 P213 N116 P215 DR
J§ALU_J402 N135 CLK P216 DR
R§ALU_R340 VDD N135 100k
J§ALU_J403 VDD N135 P217 DR
R§ALU_R341 P217 N143 1k
R§ALU_R342 N143 VSS 4.8k
J§ALU_J404 P216 N146 P218 DR
J§ALU_J405 N112 N115 P219 DR
R§ALU_R343 VDD N112 100k
J§ALU_J406 VDD N112 P220 DR
R§ALU_R344 P220 N103 1k
R§ALU_R345 N103 VSS 4.8k
J§ALU_J407 P219 N104 0 DR
J§ALU_J408 N133 N103 P221 DR
R§ALU_R346 VDD N133 100k
J§ALU_J409 VDD N133 P222 DR
R§ALU_R347 P222 N104 1k
R§ALU_R348 N104 VSS 4.8k
J§ALU_J410 P221 N143 0 DR
J§ALU_J411 P215 CLK 0 DR
J§ALU_J412 P218 N103 0 DR
J§ALU_J413 N113 N103 0 DR
R§ALU_R349 VDD N113 50k
J§ALU_J414 VDD N113 P223 DR
R§ALU_R350 P223 !InvertTemp 1k
R§ALU_R351 !InvertTemp VSS 4.5k
J§ALU_J415 N128 !InvertTemp 0 DR
R§ALU_R352 VDD N128 50k
J§ALU_J416 VDD N128 P224 DR
R§ALU_R353 P224 InvertTemp 1k
R§ALU_R354 InvertTemp VSS 4.5k
R§ALU_R355 VDD EO_Out 100k
J§ALU_J417 VDD EO_Out P225 DR
R§ALU_R356 P225 !EO_Outing 1k
R§ALU_R357 !EO_Outing VSS 4.8k
J§ALU_J418 N012 !EO_Outing 0 DR
R§ALU_R358 VDD N012 50k
J§ALU_J419 VDD N012 P226 DR
R§ALU_R359 P226 EO_Outing 1k
R§ALU_R360 EO_Outing VSS 4.5k
J§ALU_J420 N190 Acc2 P227 DR
R§ALU_R361 VDD N190 100k
J§ALU_J421 VDD N190 P228 DR
R§ALU_R362 P228 N197 1k
R§ALU_R363 N197 VSS 4.8k
J§ALU_J422 N190 CF0 P229 DR
J§ALU_J423 N193 N197 0 DR
R§ALU_R364 VDD N193 50k
J§ALU_J424 VDD N193 P230 DR
R§ALU_R365 P230 Temp3In 1k
R§ALU_R366 Temp3In VSS 4.5k
J§ALU_J425 P227 Shift_Left 0 DR
J§ALU_J426 P229 Shift_Right 0 DR
J§ALU_J427 N190 Bus3 P231 DR
J§ALU_J428 P231 !Shift_ 0 DR
J§ALU_J429 N191 Acc1 P232 DR
R§ALU_R367 VDD N191 100k
J§ALU_J430 VDD N191 P233 DR
R§ALU_R368 P233 N198 1k
R§ALU_R369 N198 VSS 4.8k
J§ALU_J431 N191 Acc3 P234 DR
J§ALU_J432 N194 N198 0 DR
R§ALU_R370 VDD N194 50k
J§ALU_J433 VDD N194 P235 DR
R§ALU_R371 P235 Temp2In 1k
R§ALU_R372 Temp2In VSS 4.5k
J§ALU_J434 P232 Shift_Left 0 DR
J§ALU_J435 P234 Shift_Right 0 DR
J§ALU_J436 N191 Bus2 P236 DR
J§ALU_J437 P236 !Shift_ 0 DR
J§ALU_J438 N203 Acc0 P237 DR
R§ALU_R373 VDD N203 100k
J§ALU_J439 VDD N203 P238 DR
R§ALU_R374 P238 N212 1k
R§ALU_R375 N212 VSS 4.8k
J§ALU_J440 N203 Acc2 P239 DR
J§ALU_J441 N208 N212 0 DR
R§ALU_R376 VDD N208 50k
J§ALU_J442 VDD N208 P240 DR
R§ALU_R377 P240 Temp1In 1k
R§ALU_R378 Temp1In VSS 4.5k
J§ALU_J443 P237 Shift_Left 0 DR
J§ALU_J444 P239 Shift_Right 0 DR
J§ALU_J445 N203 Bus1 P241 DR
J§ALU_J446 P241 !Shift_ 0 DR
J§ALU_J447 N204 CF0 P242 DR
R§ALU_R379 VDD N204 100k
J§ALU_J448 VDD N204 P243 DR
R§ALU_R380 P243 N213 1k
R§ALU_R381 N213 VSS 4.8k
J§ALU_J449 N204 Acc1 P244 DR
J§ALU_J450 N209 N213 0 DR
R§ALU_R382 VDD N209 50k
J§ALU_J451 VDD N209 P245 DR
R§ALU_R383 P245 Temp0In 1k
R§ALU_R384 Temp0In VSS 4.5k
J§ALU_J452 P242 Shift_Left 0 DR
J§ALU_J453 P244 Shift_Right 0 DR
J§ALU_J454 N204 Bus0 P246 DR
J§ALU_J455 P246 !Shift_ 0 DR
J§ALU_J456 N207 Acc3 P247 DR
R§ALU_R385 VDD N207 100k
J§ALU_J457 VDD N207 P248 DR
R§ALU_R386 P248 N214 1k
R§ALU_R387 N214 VSS 4.8k
J§ALU_J458 N207 Acc0 P249 DR
J§ALU_J459 N210 N214 0 DR
R§ALU_R388 VDD N210 50k
J§ALU_J460 VDD N210 P250 DR
R§ALU_R389 P250 SumCFRotated 1k
R§ALU_R390 SumCFRotated VSS 4.5k
J§ALU_J461 P247 Shift_Left 0 DR
J§ALU_J462 P249 Shift_Right 0 DR
J§ALU_J463 N207 SUMCF P251 DR
J§ALU_J464 P251 !Shift_ 0 DR
R§ALU_R391 VDD Shift_Enable 100k
J§ALU_J465 VDD Shift_Enable P252 DR
R§ALU_R392 P252 !Shift_ 1k
R§ALU_R393 !Shift_ VSS 4.8k
J§ALU_J466 N189 !Shift_ 0 DR
R§ALU_R394 VDD N189 50k
J§ALU_J467 VDD N189 P253 DR
R§ALU_R395 P253 N196 1k
R§ALU_R396 N196 VSS 4.5k
R§ALU_R397 VDD Shift_Direction 100k
J§ALU_J468 VDD Shift_Direction P254 DR
R§ALU_R398 P254 N205 1k
R§ALU_R399 N205 VSS 4.8k
J§ALU_J469 N201 N205 0 DR
R§ALU_R400 VDD N201 50k
J§ALU_J470 VDD N201 P255 DR
R§ALU_R401 P255 N200 1k
R§ALU_R402 N200 VSS 4.5k
R§ALU_R403 VDD N192 100k
J§ALU_J471 VDD N192 P256 DR
R§ALU_R404 P256 N199 1k
R§ALU_R405 N199 VSS 4.8k
J§ALU_J472 N192 N196 P257 DR
J§ALU_J473 N195 N199 0 DR
R§ALU_R406 VDD N195 50k
J§ALU_J474 VDD N195 P258 DR
R§ALU_R407 P258 Shift_Left 1k
R§ALU_R408 Shift_Left VSS 4.5k
J§ALU_J475 P257 N200 0 DR
R§ALU_R409 VDD N202 100k
J§ALU_J476 VDD N202 P259 DR
R§ALU_R410 P259 N211 1k
R§ALU_R411 N211 VSS 4.8k
J§ALU_J477 N202 N196 P260 DR
J§ALU_J478 N206 N211 0 DR
R§ALU_R412 VDD N206 50k
J§ALU_J479 VDD N206 P261 DR
R§ALU_R413 P261 Shift_Right 1k
R§ALU_R414 Shift_Right VSS 4.5k
J§ALU_J480 P260 N205 0 DR
R§ALU_R415 VDD CFStage1_Load 100k
J§ALU_J481 VDD CFStage1_Load P262 DR
R§ALU_R416 P262 !CFStage1_Loading 1k
R§ALU_R417 !CFStage1_Loading VSS 4.8k
J§ALU_J482 N013 !CFStage1_Loading 0 DR
R§ALU_R418 VDD N013 50k
J§ALU_J483 VDD N013 P263 DR
R§ALU_R419 P263 CFStage1_Loading 1k
R§ALU_R420 CFStage1_Loading VSS 4.5k
J§ALU_J484 N154 Acc3 P264 DR
J§ALU_J485 P264 Acc2 0 DR
J§ALU_J486 N154 T_Q3 P265 DR
J§ALU_J487 P265 Acc2 0 DR
J§ALU_J488 N178 N172 0 DR
R§ALU_R421 VDD N178 50k
J§ALU_J489 VDD N178 P266 DR
R§ALU_R422 P266 SUMCF 1k
R§ALU_R423 SUMCF VSS 4.5k
J§ALU_J490 N188 N172 0 DR
R§ALU_R424 VDD N188 50k
J§ALU_J491 VDD N188 P267 DR
R§ALU_R425 P267 SUMCF 1k
R§ALU_R426 SUMCF VSS 4.5k
J§IR_J1 P268 IR2_3 0 DR
J§IR_J2 Bus3In IR2_Outing P268 DR
J§IR_J3 P269 IR2_2 0 DR
J§IR_J4 Bus2In IR2_Outing P269 DR
J§IR_J5 P270 IR2_1 0 DR
J§IR_J6 Bus1In IR2_Outing P270 DR
J§IR_J7 P271 IR2_0 0 DR
J§IR_J8 Bus0In IR2_Outing P271 DR
J§IR_J9 P272 IR3_3 0 DR
J§IR_J10 Bus3In IR3_Outing P272 DR
J§IR_J11 P273 IR3_2 0 DR
J§IR_J12 Bus2In IR3_Outing P273 DR
J§IR_J13 P274 IR3_1 0 DR
J§IR_J14 Bus1In IR3_Outing P274 DR
J§IR_J15 P275 IR3_0 0 DR
J§IR_J16 Bus0In IR3_Outing P275 DR
J§IR_J17 P276 IR4_3 0 DR
J§IR_J18 Bus3In IR4_Outing P276 DR
J§IR_J19 P277 IR4_2 0 DR
J§IR_J20 Bus2In IR4_Outing P277 DR
J§IR_J21 P278 IR4_1 0 DR
J§IR_J22 Bus1In IR4_Outing P278 DR
J§IR_J23 P279 IR4_0 0 DR
J§IR_J24 Bus0In IR4_Outing P279 DR
J§IR_J25 N218 N222 P280 DR
R§IR_R1 VDD N218 100k
J§IR_J26 VDD N218 P281 DR
R§IR_R2 P281 IR1_3 1k
R§IR_R3 IR1_3 VSS 4.8k
J§IR_J27 N218 _IR1_3 0 DR
J§IR_J28 N238 N234 P282 DR
R§IR_R4 VDD N238 100k
J§IR_J29 VDD N238 P283 DR
R§IR_R5 P283 _IR1_3 1k
R§IR_R6 _IR1_3 VSS 4.8k
J§IR_J30 N238 IR1_3 0 DR
J§IR_J31 P280 CLK 0 DR
J§IR_J32 P282 CLK 0 DR
J§IR_J33 N226 IR1_3 P284 DR
R§IR_R7 VDD N226 100k
J§IR_J34 VDD N226 P285 DR
R§IR_R8 P285 N222 1k
R§IR_R9 N222 VSS 4.8k
J§IR_J35 N226 IR1_3_In P286 DR
J§IR_J36 N230 N222 0 DR
R§IR_R10 VDD N230 50k
J§IR_J37 VDD N230 P287 DR
R§IR_R11 P287 N234 1k
R§IR_R12 N234 VSS 4.5k
J§IR_J38 P284 _IR1_Loading 0 DR
J§IR_J39 P286 IR_Loading 0 DR
J§IR_J40 N219 N223 P288 DR
R§IR_R13 VDD N219 100k
J§IR_J41 VDD N219 P289 DR
R§IR_R14 P289 IR1_2 1k
R§IR_R15 IR1_2 VSS 4.8k
J§IR_J42 N219 _IR1_2 0 DR
J§IR_J43 N239 N235 P290 DR
R§IR_R16 VDD N239 100k
J§IR_J44 VDD N239 P291 DR
R§IR_R17 P291 _IR1_2 1k
R§IR_R18 _IR1_2 VSS 4.8k
J§IR_J45 N239 IR1_2 0 DR
J§IR_J46 P288 CLK 0 DR
J§IR_J47 P290 CLK 0 DR
J§IR_J48 N227 IR1_2 P292 DR
R§IR_R19 VDD N227 100k
J§IR_J49 VDD N227 P293 DR
R§IR_R20 P293 N223 1k
R§IR_R21 N223 VSS 4.8k
J§IR_J50 N227 IR1_2_In P294 DR
J§IR_J51 N231 N223 0 DR
R§IR_R22 VDD N231 50k
J§IR_J52 VDD N231 P295 DR
R§IR_R23 P295 N235 1k
R§IR_R24 N235 VSS 4.5k
J§IR_J53 P292 _IR1_Loading 0 DR
J§IR_J54 P294 IR_Loading 0 DR
J§IR_J55 N242 N246 P296 DR
R§IR_R25 VDD N242 100k
J§IR_J56 VDD N242 P297 DR
R§IR_R26 P297 IR1_1 1k
R§IR_R27 IR1_1 VSS 4.8k
J§IR_J57 N242 _IR1_1 0 DR
J§IR_J58 N262 N258 P298 DR
R§IR_R28 VDD N262 100k
J§IR_J59 VDD N262 P299 DR
R§IR_R29 P299 _IR1_1 1k
R§IR_R30 _IR1_1 VSS 4.8k
J§IR_J60 N262 IR1_1 0 DR
J§IR_J61 P296 CLK 0 DR
J§IR_J62 P298 CLK 0 DR
J§IR_J63 N250 IR1_1 P300 DR
R§IR_R31 VDD N250 100k
J§IR_J64 VDD N250 P301 DR
R§IR_R32 P301 N246 1k
R§IR_R33 N246 VSS 4.8k
J§IR_J65 N250 IR1_1_In P302 DR
J§IR_J66 N254 N246 0 DR
R§IR_R34 VDD N254 50k
J§IR_J67 VDD N254 P303 DR
R§IR_R35 P303 N258 1k
R§IR_R36 N258 VSS 4.5k
J§IR_J68 P300 _IR1_Loading 0 DR
J§IR_J69 P302 IR_Loading 0 DR
J§IR_J70 N243 N247 P304 DR
R§IR_R37 VDD N243 100k
J§IR_J71 VDD N243 P305 DR
R§IR_R38 P305 IR1_0 1k
R§IR_R39 IR1_0 VSS 4.8k
J§IR_J72 N243 _IR1_0 0 DR
J§IR_J73 N263 N259 P306 DR
R§IR_R40 VDD N263 100k
J§IR_J74 VDD N263 P307 DR
R§IR_R41 P307 _IR1_0 1k
R§IR_R42 _IR1_0 VSS 4.8k
J§IR_J75 N263 IR1_0 0 DR
J§IR_J76 P304 CLK 0 DR
J§IR_J77 P306 CLK 0 DR
J§IR_J78 N251 IR1_0 P308 DR
R§IR_R43 VDD N251 100k
J§IR_J79 VDD N251 P309 DR
R§IR_R44 P309 N247 1k
R§IR_R45 N247 VSS 4.8k
J§IR_J80 N251 IR1_0_In P310 DR
J§IR_J81 N255 N247 0 DR
R§IR_R46 VDD N255 50k
J§IR_J82 VDD N255 P311 DR
R§IR_R47 P311 N259 1k
R§IR_R48 N259 VSS 4.5k
J§IR_J83 P308 _IR1_Loading 0 DR
J§IR_J84 P310 IR_Loading 0 DR
J§IR_J85 N215 IR_Loading 0 DR
R§IR_R49 VDD N215 50k
J§IR_J86 VDD N215 P312 DR
R§IR_R50 P312 _IR1_Loading 1k
R§IR_R51 _IR1_Loading VSS 4.5k
J§IR_J87 N220 N224 P313 DR
R§IR_R52 VDD N220 100k
J§IR_J88 VDD N220 P314 DR
R§IR_R53 P314 IR2_3 1k
R§IR_R54 IR2_3 VSS 4.8k
J§IR_J89 N220 _IR2_3 0 DR
J§IR_J90 N240 N236 P315 DR
R§IR_R55 VDD N240 100k
J§IR_J91 VDD N240 P316 DR
R§IR_R56 P316 _IR2_3 1k
R§IR_R57 _IR2_3 VSS 4.8k
J§IR_J92 N240 IR2_3 0 DR
J§IR_J93 P313 CLK 0 DR
J§IR_J94 P315 CLK 0 DR
J§IR_J95 N228 IR2_3 P317 DR
R§IR_R58 VDD N228 100k
J§IR_J96 VDD N228 P318 DR
R§IR_R59 P318 N224 1k
R§IR_R60 N224 VSS 4.8k
J§IR_J97 N228 IR2_3_In P319 DR
J§IR_J98 N232 N224 0 DR
R§IR_R61 VDD N232 50k
J§IR_J99 VDD N232 P320 DR
R§IR_R62 P320 N236 1k
R§IR_R63 N236 VSS 4.5k
J§IR_J100 P317 _IR1_Loading 0 DR
J§IR_J101 P319 IR_Loading 0 DR
J§IR_J102 N221 N225 P321 DR
R§IR_R64 VDD N221 100k
J§IR_J103 VDD N221 P322 DR
R§IR_R65 P322 IR2_2 1k
R§IR_R66 IR2_2 VSS 4.8k
J§IR_J104 N221 _IR2_2 0 DR
J§IR_J105 N241 N237 P323 DR
R§IR_R67 VDD N241 100k
J§IR_J106 VDD N241 P324 DR
R§IR_R68 P324 _IR2_2 1k
R§IR_R69 _IR2_2 VSS 4.8k
J§IR_J107 N241 IR2_2 0 DR
J§IR_J108 P321 CLK 0 DR
J§IR_J109 P323 CLK 0 DR
J§IR_J110 N229 IR2_2 P325 DR
R§IR_R70 VDD N229 100k
J§IR_J111 VDD N229 P326 DR
R§IR_R71 P326 N225 1k
R§IR_R72 N225 VSS 4.8k
J§IR_J112 N229 IR2_2_In P327 DR
J§IR_J113 N233 N225 0 DR
R§IR_R73 VDD N233 50k
J§IR_J114 VDD N233 P328 DR
R§IR_R74 P328 N237 1k
R§IR_R75 N237 VSS 4.5k
J§IR_J115 P325 _IR1_Loading 0 DR
J§IR_J116 P327 IR_Loading 0 DR
J§IR_J117 N244 N248 P329 DR
R§IR_R76 VDD N244 100k
J§IR_J118 VDD N244 P330 DR
R§IR_R77 P330 IR2_1 1k
R§IR_R78 IR2_1 VSS 4.8k
J§IR_J119 N244 _IR2_1 0 DR
J§IR_J120 N264 N260 P331 DR
R§IR_R79 VDD N264 100k
J§IR_J121 VDD N264 P332 DR
R§IR_R80 P332 _IR2_1 1k
R§IR_R81 _IR2_1 VSS 4.8k
J§IR_J122 N264 IR2_1 0 DR
J§IR_J123 P329 CLK 0 DR
J§IR_J124 P331 CLK 0 DR
J§IR_J125 N252 IR2_1 P333 DR
R§IR_R82 VDD N252 100k
J§IR_J126 VDD N252 P334 DR
R§IR_R83 P334 N248 1k
R§IR_R84 N248 VSS 4.8k
J§IR_J127 N252 IR2_1_In P335 DR
J§IR_J128 N256 N248 0 DR
R§IR_R85 VDD N256 50k
J§IR_J129 VDD N256 P336 DR
R§IR_R86 P336 N260 1k
R§IR_R87 N260 VSS 4.5k
J§IR_J130 P333 _IR1_Loading 0 DR
J§IR_J131 P335 IR_Loading 0 DR
J§IR_J132 N245 N249 P337 DR
R§IR_R88 VDD N245 100k
J§IR_J133 VDD N245 P338 DR
R§IR_R89 P338 IR2_0 1k
R§IR_R90 IR2_0 VSS 4.8k
J§IR_J134 N245 _IR2_0 0 DR
J§IR_J135 N265 N261 P339 DR
R§IR_R91 VDD N265 100k
J§IR_J136 VDD N265 P340 DR
R§IR_R92 P340 _IR2_0 1k
R§IR_R93 _IR2_0 VSS 4.8k
J§IR_J137 N265 IR2_0 0 DR
J§IR_J138 P337 CLK 0 DR
J§IR_J139 P339 CLK 0 DR
J§IR_J140 N253 IR2_0 P341 DR
R§IR_R94 VDD N253 100k
J§IR_J141 VDD N253 P342 DR
R§IR_R95 P342 N249 1k
R§IR_R96 N249 VSS 4.8k
J§IR_J142 N253 IR2_0_In P343 DR
J§IR_J143 N257 N249 0 DR
R§IR_R97 VDD N257 50k
J§IR_J144 VDD N257 P344 DR
R§IR_R98 P344 N261 1k
R§IR_R99 N261 VSS 4.5k
J§IR_J145 P341 _IR1_Loading 0 DR
J§IR_J146 P343 IR_Loading 0 DR
R§IR_R100 VDD IR2_Out 100k
J§IR_J147 VDD IR2_Out P345 DR
R§IR_R101 P345 N217 1k
R§IR_R102 N217 VSS 4.8k
J§IR_J148 N216 N217 0 DR
R§IR_R103 VDD N216 50k
J§IR_J149 VDD N216 P346 DR
R§IR_R104 P346 IR2_Outing 1k
R§IR_R105 IR2_Outing VSS 4.5k
J§IR_J150 N272 N276 P347 DR
R§IR_R106 VDD N272 100k
J§IR_J151 VDD N272 P348 DR
R§IR_R107 P348 IR3_3 1k
R§IR_R108 IR3_3 VSS 4.8k
J§IR_J152 N272 _IR3_3 0 DR
J§IR_J153 N292 N288 P349 DR
R§IR_R109 VDD N292 100k
J§IR_J154 VDD N292 P350 DR
R§IR_R110 P350 _IR3_3 1k
R§IR_R111 _IR3_3 VSS 4.8k
J§IR_J155 N292 IR3_3 0 DR
J§IR_J156 P347 CLK 0 DR
J§IR_J157 P349 CLK 0 DR
J§IR_J158 N280 IR3_3 P351 DR
R§IR_R112 VDD N280 100k
J§IR_J159 VDD N280 P352 DR
R§IR_R113 P352 N276 1k
R§IR_R114 N276 VSS 4.8k
J§IR_J160 N280 IR3_3_In P353 DR
J§IR_J161 N284 N276 0 DR
R§IR_R115 VDD N284 50k
J§IR_J162 VDD N284 P354 DR
R§IR_R116 P354 N288 1k
R§IR_R117 N288 VSS 4.5k
J§IR_J163 P351 _IR1_Loading 0 DR
J§IR_J164 P353 IR_Loading 0 DR
J§IR_J165 N273 N277 P355 DR
R§IR_R118 VDD N273 100k
J§IR_J166 VDD N273 P356 DR
R§IR_R119 P356 IR3_2 1k
R§IR_R120 IR3_2 VSS 4.8k
J§IR_J167 N273 _IR3_2 0 DR
J§IR_J168 N293 N289 P357 DR
R§IR_R121 VDD N293 100k
J§IR_J169 VDD N293 P358 DR
R§IR_R122 P358 _IR3_2 1k
R§IR_R123 _IR3_2 VSS 4.8k
J§IR_J170 N293 IR3_2 0 DR
J§IR_J171 P355 CLK 0 DR
J§IR_J172 P357 CLK 0 DR
J§IR_J173 N281 IR3_2 P359 DR
R§IR_R124 VDD N281 100k
J§IR_J174 VDD N281 P360 DR
R§IR_R125 P360 N277 1k
R§IR_R126 N277 VSS 4.8k
J§IR_J175 N281 IR3_2_In P361 DR
J§IR_J176 N285 N277 0 DR
R§IR_R127 VDD N285 50k
J§IR_J177 VDD N285 P362 DR
R§IR_R128 P362 N289 1k
R§IR_R129 N289 VSS 4.5k
J§IR_J178 P359 _IR1_Loading 0 DR
J§IR_J179 P361 IR_Loading 0 DR
J§IR_J180 N296 N300 P363 DR
R§IR_R130 VDD N296 100k
J§IR_J181 VDD N296 P364 DR
R§IR_R131 P364 IR3_1 1k
R§IR_R132 IR3_1 VSS 4.8k
J§IR_J182 N296 _IR3_1 0 DR
J§IR_J183 N316 N312 P365 DR
R§IR_R133 VDD N316 100k
J§IR_J184 VDD N316 P366 DR
R§IR_R134 P366 _IR3_1 1k
R§IR_R135 _IR3_1 VSS 4.8k
J§IR_J185 N316 IR3_1 0 DR
J§IR_J186 P363 CLK 0 DR
J§IR_J187 P365 CLK 0 DR
J§IR_J188 N304 IR3_1 P367 DR
R§IR_R136 VDD N304 100k
J§IR_J189 VDD N304 P368 DR
R§IR_R137 P368 N300 1k
R§IR_R138 N300 VSS 4.8k
J§IR_J190 N304 IR3_1_In P369 DR
J§IR_J191 N308 N300 0 DR
R§IR_R139 VDD N308 50k
J§IR_J192 VDD N308 P370 DR
R§IR_R140 P370 N312 1k
R§IR_R141 N312 VSS 4.5k
J§IR_J193 P367 _IR1_Loading 0 DR
J§IR_J194 P369 IR_Loading 0 DR
J§IR_J195 N297 N301 P371 DR
R§IR_R142 VDD N297 100k
J§IR_J196 VDD N297 P372 DR
R§IR_R143 P372 IR3_0 1k
R§IR_R144 IR3_0 VSS 4.8k
J§IR_J197 N297 _IR3_0 0 DR
J§IR_J198 N317 N313 P373 DR
R§IR_R145 VDD N317 100k
J§IR_J199 VDD N317 P374 DR
R§IR_R146 P374 _IR3_0 1k
R§IR_R147 _IR3_0 VSS 4.8k
J§IR_J200 N317 IR3_0 0 DR
J§IR_J201 P371 CLK 0 DR
J§IR_J202 P373 CLK 0 DR
J§IR_J203 N305 IR3_0 P375 DR
R§IR_R148 VDD N305 100k
J§IR_J204 VDD N305 P376 DR
R§IR_R149 P376 N301 1k
R§IR_R150 N301 VSS 4.8k
J§IR_J205 N305 IR3_0_In P377 DR
J§IR_J206 N309 N301 0 DR
R§IR_R151 VDD N309 50k
J§IR_J207 VDD N309 P378 DR
R§IR_R152 P378 N313 1k
R§IR_R153 N313 VSS 4.5k
J§IR_J208 P375 _IR1_Loading 0 DR
J§IR_J209 P377 IR_Loading 0 DR
R§IR_R154 VDD IR3_Out 100k
J§IR_J210 VDD IR3_Out P379 DR
R§IR_R155 P379 N269 1k
R§IR_R156 N269 VSS 4.8k
J§IR_J211 N267 N269 0 DR
R§IR_R157 VDD N267 50k
J§IR_J212 VDD N267 P380 DR
R§IR_R158 P380 IR3_Outing 1k
R§IR_R159 IR3_Outing VSS 4.5k
J§IR_J213 N270 N274 P381 DR
R§IR_R160 VDD N270 100k
J§IR_J214 VDD N270 P382 DR
R§IR_R161 P382 IR4_3 1k
R§IR_R162 IR4_3 VSS 4.8k
J§IR_J215 N270 _IR4_3 0 DR
J§IR_J216 N290 N286 P383 DR
R§IR_R163 VDD N290 100k
J§IR_J217 VDD N290 P384 DR
R§IR_R164 P384 _IR4_3 1k
R§IR_R165 _IR4_3 VSS 4.8k
J§IR_J218 N290 IR4_3 0 DR
J§IR_J219 P381 CLK 0 DR
J§IR_J220 P383 CLK 0 DR
J§IR_J221 N278 IR4_3 P385 DR
R§IR_R166 VDD N278 100k
J§IR_J222 VDD N278 P386 DR
R§IR_R167 P386 N274 1k
R§IR_R168 N274 VSS 4.8k
J§IR_J223 N278 IR4_3_In P387 DR
J§IR_J224 N282 N274 0 DR
R§IR_R169 VDD N282 50k
J§IR_J225 VDD N282 P388 DR
R§IR_R170 P388 N286 1k
R§IR_R171 N286 VSS 4.5k
J§IR_J226 P385 _IR1_Loading 0 DR
J§IR_J227 P387 IR_Loading 0 DR
J§IR_J228 N271 N275 P389 DR
R§IR_R172 VDD N271 100k
J§IR_J229 VDD N271 P390 DR
R§IR_R173 P390 IR4_2 1k
R§IR_R174 IR4_2 VSS 4.8k
J§IR_J230 N271 _IR4_2 0 DR
J§IR_J231 N291 N287 P391 DR
R§IR_R175 VDD N291 100k
J§IR_J232 VDD N291 P392 DR
R§IR_R176 P392 _IR4_2 1k
R§IR_R177 _IR4_2 VSS 4.8k
J§IR_J233 N291 IR4_2 0 DR
J§IR_J234 P389 CLK 0 DR
J§IR_J235 P391 CLK 0 DR
J§IR_J236 N279 IR4_2 P393 DR
R§IR_R178 VDD N279 100k
J§IR_J237 VDD N279 P394 DR
R§IR_R179 P394 N275 1k
R§IR_R180 N275 VSS 4.8k
J§IR_J238 N279 IR4_2_In P395 DR
J§IR_J239 N283 N275 0 DR
R§IR_R181 VDD N283 50k
J§IR_J240 VDD N283 P396 DR
R§IR_R182 P396 N287 1k
R§IR_R183 N287 VSS 4.5k
J§IR_J241 P393 _IR1_Loading 0 DR
J§IR_J242 P395 IR_Loading 0 DR
J§IR_J243 N294 N298 P397 DR
R§IR_R184 VDD N294 100k
J§IR_J244 VDD N294 P398 DR
R§IR_R185 P398 IR4_1 1k
R§IR_R186 IR4_1 VSS 4.8k
J§IR_J245 N294 _IR4_1 0 DR
J§IR_J246 N314 N310 P399 DR
R§IR_R187 VDD N314 100k
J§IR_J247 VDD N314 P400 DR
R§IR_R188 P400 _IR4_1 1k
R§IR_R189 _IR4_1 VSS 4.8k
J§IR_J248 N314 IR4_1 0 DR
J§IR_J249 P397 CLK 0 DR
J§IR_J250 P399 CLK 0 DR
J§IR_J251 N302 IR4_1 P401 DR
R§IR_R190 VDD N302 100k
J§IR_J252 VDD N302 P402 DR
R§IR_R191 P402 N298 1k
R§IR_R192 N298 VSS 4.8k
J§IR_J253 N302 IR4_1_In P403 DR
J§IR_J254 N306 N298 0 DR
R§IR_R193 VDD N306 50k
J§IR_J255 VDD N306 P404 DR
R§IR_R194 P404 N310 1k
R§IR_R195 N310 VSS 4.5k
J§IR_J256 P401 _IR1_Loading 0 DR
J§IR_J257 P403 IR_Loading 0 DR
J§IR_J258 N295 N299 P405 DR
R§IR_R196 VDD N295 100k
J§IR_J259 VDD N295 P406 DR
R§IR_R197 P406 IR4_0 1k
R§IR_R198 IR4_0 VSS 4.8k
J§IR_J260 N295 _IR4_0 0 DR
J§IR_J261 N315 N311 P407 DR
R§IR_R199 VDD N315 100k
J§IR_J262 VDD N315 P408 DR
R§IR_R200 P408 _IR4_0 1k
R§IR_R201 _IR4_0 VSS 4.8k
J§IR_J263 N315 IR4_0 0 DR
J§IR_J264 P405 CLK 0 DR
J§IR_J265 P407 CLK 0 DR
J§IR_J266 N303 IR4_0 P409 DR
R§IR_R202 VDD N303 100k
J§IR_J267 VDD N303 P410 DR
R§IR_R203 P410 N299 1k
R§IR_R204 N299 VSS 4.8k
J§IR_J268 N303 IR4_0_In P411 DR
J§IR_J269 N307 N299 0 DR
R§IR_R205 VDD N307 50k
J§IR_J270 VDD N307 P412 DR
R§IR_R206 P412 N311 1k
R§IR_R207 N311 VSS 4.5k
J§IR_J271 P409 _IR1_Loading 0 DR
J§IR_J272 P411 IR_Loading 0 DR
R§IR_R208 VDD IR4_Out 100k
J§IR_J273 VDD IR4_Out P413 DR
R§IR_R209 P413 N268 1k
R§IR_R210 N268 VSS 4.8k
J§IR_J274 N266 N268 0 DR
R§IR_R211 VDD N266 50k
J§IR_J275 VDD N266 P414 DR
R§IR_R212 P414 IR4_Outing 1k
R§IR_R213 IR4_Outing VSS 4.5k
J§IR_J276 N318 _IR1_3 P415 DR
R§IR_R214 VDD N318 100k
J§IR_J277 VDD N318 P416 DR
R§IR_R215 P416 N330 1k
R§IR_R216 N330 VSS 4.8k
J§IR_J278 P415 _IR1_2 0 DR
J§IR_J279 N324 N330 0 DR
R§IR_R217 VDD N324 50k
J§IR_J280 VDD N324 P417 DR
R§IR_R218 P417 A0 1k
R§IR_R219 A0 VSS 4.5k
J§IR_J281 N319 _IR1_1 P418 DR
R§IR_R220 VDD N319 100k
J§IR_J282 VDD N319 P419 DR
R§IR_R221 P419 N331 1k
R§IR_R222 N331 VSS 4.8k
J§IR_J283 P418 _IR1_0 0 DR
J§IR_J284 N325 N331 0 DR
R§IR_R223 VDD N325 50k
J§IR_J285 VDD N325 P420 DR
R§IR_R224 P420 B0 1k
R§IR_R225 B0 VSS 4.5k
J§IR_J286 N336 _IR1_3 P421 DR
R§IR_R226 VDD N336 100k
J§IR_J287 VDD N336 P422 DR
R§IR_R227 P422 N348 1k
R§IR_R228 N348 VSS 4.8k
J§IR_J288 P421 IR1_2 0 DR
J§IR_J289 N342 N348 0 DR
R§IR_R229 VDD N342 50k
J§IR_J290 VDD N342 P423 DR
R§IR_R230 P423 A1 1k
R§IR_R231 A1 VSS 4.5k
J§IR_J291 N354 IR1_3 P424 DR
R§IR_R232 VDD N354 100k
J§IR_J292 VDD N354 P425 DR
R§IR_R233 P425 N364 1k
R§IR_R234 N364 VSS 4.8k
J§IR_J293 P424 _IR1_2 0 DR
J§IR_J294 N359 N364 0 DR
R§IR_R235 VDD N359 50k
J§IR_J295 VDD N359 P426 DR
R§IR_R236 P426 A2 1k
R§IR_R237 A2 VSS 4.5k
J§IR_J296 N369 IR1_3 P427 DR
R§IR_R238 VDD N369 100k
J§IR_J297 VDD N369 P428 DR
R§IR_R239 P428 N379 1k
R§IR_R240 N379 VSS 4.8k
J§IR_J298 P427 IR1_2 0 DR
J§IR_J299 N374 N379 0 DR
R§IR_R241 VDD N374 50k
J§IR_J300 VDD N374 P429 DR
R§IR_R242 P429 A3 1k
R§IR_R243 A3 VSS 4.5k
J§IR_J301 N341 _IR1_1 P430 DR
R§IR_R244 VDD N341 100k
J§IR_J302 VDD N341 P431 DR
R§IR_R245 P431 N353 1k
R§IR_R246 N353 VSS 4.8k
J§IR_J303 P430 IR1_0 0 DR
J§IR_J304 N347 N353 0 DR
R§IR_R247 VDD N347 50k
J§IR_J305 VDD N347 P432 DR
R§IR_R248 P432 B1 1k
R§IR_R249 B1 VSS 4.5k
J§IR_J306 N358 IR1_1 P433 DR
R§IR_R250 VDD N358 100k
J§IR_J307 VDD N358 P434 DR
R§IR_R251 P434 N368 1k
R§IR_R252 N368 VSS 4.8k
J§IR_J308 P433 _IR1_0 0 DR
J§IR_J309 N363 N368 0 DR
R§IR_R253 VDD N363 50k
J§IR_J310 VDD N363 P435 DR
R§IR_R254 P435 B2 1k
R§IR_R255 B2 VSS 4.5k
J§IR_J311 N373 IR1_1 P436 DR
R§IR_R256 VDD N373 100k
J§IR_J312 VDD N373 P437 DR
R§IR_R257 P437 N383 1k
R§IR_R258 N383 VSS 4.8k
J§IR_J313 P436 IR1_0 0 DR
J§IR_J314 N378 N383 0 DR
R§IR_R259 VDD N378 50k
J§IR_J315 VDD N378 P438 DR
R§IR_R260 P438 B3 1k
R§IR_R261 B3 VSS 4.5k
J§IR_J316 N320 A0 P439 DR
R§IR_R262 VDD N320 100k
J§IR_J317 VDD N320 P440 DR
R§IR_R263 P440 N332 1k
R§IR_R264 N332 VSS 4.8k
J§IR_J318 P439 B0 0 DR
J§IR_J319 N326 N332 0 DR
R§IR_R265 VDD N326 50k
J§IR_J320 VDD N326 P441 DR
R§IR_R266 P441 M0 1k
R§IR_R267 M0 VSS 4.5k
J§IR_J321 N337 A0 P442 DR
R§IR_R268 VDD N337 100k
J§IR_J322 VDD N337 P443 DR
R§IR_R269 P443 N349 1k
R§IR_R270 N349 VSS 4.8k
J§IR_J323 P442 B1 0 DR
J§IR_J324 N343 N349 0 DR
R§IR_R271 VDD N343 50k
J§IR_J325 VDD N343 P444 DR
R§IR_R272 P444 JCN 1k
R§IR_R273 JCN VSS 4.5k
J§IR_J326 N355 A0 P445 DR
R§IR_R274 VDD N355 100k
J§IR_J327 VDD N355 P446 DR
R§IR_R275 P446 N365 1k
R§IR_R276 N365 VSS 4.8k
J§IR_J328 P445 B2 0 DR
J§IR_J329 N360 N365 0 DR
R§IR_R277 VDD N360 50k
J§IR_J330 VDD N360 P447 DR
R§IR_R278 P447 FIM 1k
R§IR_R279 FIM VSS 4.5k
J§IR_J331 N370 A0 P448 DR
R§IR_R280 VDD N370 100k
J§IR_J332 VDD N370 P449 DR
R§IR_R281 P449 N380 1k
R§IR_R282 N380 VSS 4.8k
J§IR_J333 P448 B3 0 DR
J§IR_J334 N375 N380 0 DR
R§IR_R283 VDD N375 50k
J§IR_J335 VDD N375 P450 DR
R§IR_R284 P450 M3 1k
R§IR_R285 M3 VSS 4.5k
J§IR_J336 N321 A1 P451 DR
R§IR_R286 VDD N321 100k
J§IR_J337 VDD N321 P452 DR
R§IR_R287 P452 N333 1k
R§IR_R288 N333 VSS 4.8k
J§IR_J338 P451 B0 0 DR
J§IR_J339 N327 N333 0 DR
R§IR_R289 VDD N327 50k
J§IR_J340 VDD N327 P453 DR
R§IR_R290 P453 JUN 1k
R§IR_R291 JUN VSS 4.5k
J§IR_J341 N338 A1 P454 DR
R§IR_R292 VDD N338 100k
J§IR_J342 VDD N338 P455 DR
R§IR_R293 P455 N350 1k
R§IR_R294 N350 VSS 4.8k
J§IR_J343 P454 B1 0 DR
J§IR_J344 N344 N350 0 DR
R§IR_R295 VDD N344 50k
J§IR_J345 VDD N344 P456 DR
R§IR_R296 P456 JMS 1k
R§IR_R297 JMS VSS 4.5k
J§IR_J346 N356 A1 P457 DR
R§IR_R298 VDD N356 100k
J§IR_J347 VDD N356 P458 DR
R§IR_R299 P458 N366 1k
R§IR_R300 N366 VSS 4.8k
J§IR_J348 P457 B2 0 DR
J§IR_J349 N361 N366 0 DR
R§IR_R301 VDD N361 50k
J§IR_J350 VDD N361 P459 DR
R§IR_R302 P459 INC 1k
R§IR_R303 INC VSS 4.5k
J§IR_J351 N371 A1 P460 DR
R§IR_R304 VDD N371 100k
J§IR_J352 VDD N371 P461 DR
R§IR_R305 P461 N381 1k
R§IR_R306 N381 VSS 4.8k
J§IR_J353 P460 B3 0 DR
J§IR_J354 N376 N381 0 DR
R§IR_R307 VDD N376 50k
J§IR_J355 VDD N376 P462 DR
R§IR_R308 P462 ISZ 1k
R§IR_R309 ISZ VSS 4.5k
J§IR_J356 N322 A2 P463 DR
R§IR_R310 VDD N322 100k
J§IR_J357 VDD N322 P464 DR
R§IR_R311 P464 N334 1k
R§IR_R312 N334 VSS 4.8k
J§IR_J358 P463 B0 0 DR
J§IR_J359 N328 N334 0 DR
R§IR_R313 VDD N328 50k
J§IR_J360 VDD N328 P465 DR
R§IR_R314 P465 ADD 1k
R§IR_R315 ADD VSS 4.5k
J§IR_J361 N339 A2 P466 DR
R§IR_R316 VDD N339 100k
J§IR_J362 VDD N339 P467 DR
R§IR_R317 P467 N351 1k
R§IR_R318 N351 VSS 4.8k
J§IR_J363 P466 B1 0 DR
J§IR_J364 N345 N351 0 DR
R§IR_R319 VDD N345 50k
J§IR_J365 VDD N345 P468 DR
R§IR_R320 P468 SUB 1k
R§IR_R321 SUB VSS 4.5k
J§IR_J366 N357 A2 P469 DR
R§IR_R322 VDD N357 100k
J§IR_J367 VDD N357 P470 DR
R§IR_R323 P470 N367 1k
R§IR_R324 N367 VSS 4.8k
J§IR_J368 P469 B2 0 DR
J§IR_J369 N362 N367 0 DR
R§IR_R325 VDD N362 50k
J§IR_J370 VDD N362 P471 DR
R§IR_R326 P471 LD 1k
R§IR_R327 LD VSS 4.5k
J§IR_J371 N372 A2 P472 DR
R§IR_R328 VDD N372 100k
J§IR_J372 VDD N372 P473 DR
R§IR_R329 P473 N382 1k
R§IR_R330 N382 VSS 4.8k
J§IR_J373 P472 B3 0 DR
J§IR_J374 N377 N382 0 DR
R§IR_R331 VDD N377 50k
J§IR_J375 VDD N377 P474 DR
R§IR_R332 P474 XCH 1k
R§IR_R333 XCH VSS 4.5k
J§IR_J376 N323 A3 P475 DR
R§IR_R334 VDD N323 100k
J§IR_J377 VDD N323 P476 DR
R§IR_R335 P476 N335 1k
R§IR_R336 N335 VSS 4.8k
J§IR_J378 P475 B0 0 DR
J§IR_J379 N329 N335 0 DR
R§IR_R337 VDD N329 50k
J§IR_J380 VDD N329 P477 DR
R§IR_R338 P477 BBL 1k
R§IR_R339 BBL VSS 4.5k
J§IR_J381 N340 A3 P478 DR
R§IR_R340 VDD N340 100k
J§IR_J382 VDD N340 P479 DR
R§IR_R341 P479 N352 1k
R§IR_R342 N352 VSS 4.8k
J§IR_J383 P478 B1 0 DR
J§IR_J384 N346 N352 0 DR
R§IR_R343 VDD N346 50k
J§IR_J385 VDD N346 P480 DR
R§IR_R344 P480 LDM 1k
R§IR_R345 LDM VSS 4.5k
J§IR_J386 N385 _IR2_3 P481 DR
R§IR_R346 VDD N385 100k
J§IR_J387 VDD N385 P482 DR
R§IR_R347 P482 N397 1k
R§IR_R348 N397 VSS 4.8k
J§IR_J388 P481 _IR2_2 0 DR
J§IR_J389 N391 N397 0 DR
R§IR_R349 VDD N391 50k
J§IR_J390 VDD N391 P483 DR
R§IR_R350 P483 U0 1k
R§IR_R351 U0 VSS 4.5k
J§IR_J391 N403 _IR2_3 P484 DR
R§IR_R352 VDD N403 100k
J§IR_J392 VDD N403 P485 DR
R§IR_R353 P485 N415 1k
R§IR_R354 N415 VSS 4.8k
J§IR_J393 P484 IR2_2 0 DR
J§IR_J394 N405 N415 0 DR
R§IR_R355 VDD N405 50k
J§IR_J395 VDD N405 P486 DR
R§IR_R356 P486 U1 1k
R§IR_R357 U1 VSS 4.5k
J§IR_J396 N421 IR2_3 P487 DR
R§IR_R358 VDD N421 100k
J§IR_J397 VDD N421 P488 DR
R§IR_R359 P488 N431 1k
R§IR_R360 N431 VSS 4.8k
J§IR_J398 P487 _IR2_2 0 DR
J§IR_J399 N426 N431 0 DR
R§IR_R361 VDD N426 50k
J§IR_J400 VDD N426 P489 DR
R§IR_R362 P489 U2 1k
R§IR_R363 U2 VSS 4.5k
J§IR_J401 N439 IR2_3 P490 DR
R§IR_R364 VDD N439 100k
J§IR_J402 VDD N439 P491 DR
R§IR_R365 P491 N449 1k
R§IR_R366 N449 VSS 4.8k
J§IR_J403 P490 IR2_2 0 DR
J§IR_J404 N444 N449 0 DR
R§IR_R367 VDD N444 50k
J§IR_J405 VDD N444 P492 DR
R§IR_R368 P492 U3 1k
R§IR_R369 U3 VSS 4.5k
J§IR_J406 N384 _IR2_1 P493 DR
R§IR_R370 VDD N384 100k
J§IR_J407 VDD N384 P494 DR
R§IR_R371 P494 N396 1k
R§IR_R372 N396 VSS 4.8k
J§IR_J408 P493 _IR2_0 0 DR
J§IR_J409 N386 N396 0 DR
R§IR_R373 VDD N386 50k
J§IR_J410 VDD N386 P495 DR
R§IR_R374 P495 V0 1k
R§IR_R375 V0 VSS 4.5k
J§IR_J411 N402 _IR2_1 P496 DR
R§IR_R376 VDD N402 100k
J§IR_J412 VDD N402 P497 DR
R§IR_R377 P497 N410 1k
R§IR_R378 N410 VSS 4.8k
J§IR_J413 P496 IR2_0 0 DR
J§IR_J414 N404 N410 0 DR
R§IR_R379 VDD N404 50k
J§IR_J415 VDD N404 P498 DR
R§IR_R380 P498 V1 1k
R§IR_R381 V1 VSS 4.5k
J§IR_J416 N420 IR2_1 P499 DR
R§IR_R382 VDD N420 100k
J§IR_J417 VDD N420 P500 DR
R§IR_R383 P500 N430 1k
R§IR_R384 N430 VSS 4.8k
J§IR_J418 P499 _IR2_0 0 DR
J§IR_J419 N425 N430 0 DR
R§IR_R385 VDD N425 50k
J§IR_J420 VDD N425 P501 DR
R§IR_R386 P501 V2 1k
R§IR_R387 V2 VSS 4.5k
J§IR_J421 N435 IR2_1 P502 DR
R§IR_R388 VDD N435 100k
J§IR_J422 VDD N435 P503 DR
R§IR_R389 P503 N445 1k
R§IR_R390 N445 VSS 4.8k
J§IR_J423 P502 IR2_0 0 DR
J§IR_J424 N440 N445 0 DR
R§IR_R391 VDD N440 50k
J§IR_J425 VDD N440 P504 DR
R§IR_R392 P504 V3 1k
R§IR_R393 V3 VSS 4.5k
J§IR_J426 N387 U0 P505 DR
R§IR_R394 VDD N387 100k
J§IR_J427 VDD N387 P506 DR
R§IR_R395 P506 N398 1k
R§IR_R396 N398 VSS 4.8k
J§IR_J428 P505 V0 0 DR
J§IR_J429 N392 N398 0 DR
R§IR_R397 VDD N392 50k
J§IR_J430 VDD N392 P507 DR
R§IR_R398 P507 S0 1k
R§IR_R399 S0 VSS 4.5k
J§IR_J431 N406 U0 P508 DR
R§IR_R400 VDD N406 100k
J§IR_J432 VDD N406 P509 DR
R§IR_R401 P509 N416 1k
R§IR_R402 N416 VSS 4.8k
J§IR_J433 P508 V1 0 DR
J§IR_J434 N411 N416 0 DR
R§IR_R403 VDD N411 50k
J§IR_J435 VDD N411 P510 DR
R§IR_R404 P510 S1 1k
R§IR_R405 S1 VSS 4.5k
J§IR_J436 N422 U0 P511 DR
R§IR_R406 VDD N422 100k
J§IR_J437 VDD N422 P512 DR
R§IR_R407 P512 N432 1k
R§IR_R408 N432 VSS 4.8k
J§IR_J438 P511 V2 0 DR
J§IR_J439 N427 N432 0 DR
R§IR_R409 VDD N427 50k
J§IR_J440 VDD N427 P513 DR
R§IR_R410 P513 S2 1k
R§IR_R411 S2 VSS 4.5k
J§IR_J441 N436 U0 P514 DR
R§IR_R412 VDD N436 100k
J§IR_J442 VDD N436 P515 DR
R§IR_R413 P515 N446 1k
R§IR_R414 N446 VSS 4.8k
J§IR_J443 P514 V3 0 DR
J§IR_J444 N441 N446 0 DR
R§IR_R415 VDD N441 50k
J§IR_J445 VDD N441 P516 DR
R§IR_R416 P516 S3 1k
R§IR_R417 S3 VSS 4.5k
J§IR_J446 N388 U1 P517 DR
R§IR_R418 VDD N388 100k
J§IR_J447 VDD N388 P518 DR
R§IR_R419 P518 N399 1k
R§IR_R420 N399 VSS 4.8k
J§IR_J448 P517 V0 0 DR
J§IR_J449 N393 N399 0 DR
R§IR_R421 VDD N393 50k
J§IR_J450 VDD N393 P519 DR
R§IR_R422 P519 S4 1k
R§IR_R423 S4 VSS 4.5k
J§IR_J451 N407 U1 P520 DR
R§IR_R424 VDD N407 100k
J§IR_J452 VDD N407 P521 DR
R§IR_R425 P521 N417 1k
R§IR_R426 N417 VSS 4.8k
J§IR_J453 P520 V1 0 DR
J§IR_J454 N412 N417 0 DR
R§IR_R427 VDD N412 50k
J§IR_J455 VDD N412 P522 DR
R§IR_R428 P522 S5 1k
R§IR_R429 S5 VSS 4.5k
J§IR_J456 N423 U1 P523 DR
R§IR_R430 VDD N423 100k
J§IR_J457 VDD N423 P524 DR
R§IR_R431 P524 N433 1k
R§IR_R432 N433 VSS 4.8k
J§IR_J458 P523 V2 0 DR
J§IR_J459 N428 N433 0 DR
R§IR_R433 VDD N428 50k
J§IR_J460 VDD N428 P525 DR
R§IR_R434 P525 S6 1k
R§IR_R435 S6 VSS 4.5k
J§IR_J461 N437 U1 P526 DR
R§IR_R436 VDD N437 100k
J§IR_J462 VDD N437 P527 DR
R§IR_R437 P527 N447 1k
R§IR_R438 N447 VSS 4.8k
J§IR_J463 P526 V3 0 DR
J§IR_J464 N442 N447 0 DR
R§IR_R439 VDD N442 50k
J§IR_J465 VDD N442 P528 DR
R§IR_R440 P528 S7 1k
R§IR_R441 S7 VSS 4.5k
J§IR_J466 N389 U2 P529 DR
R§IR_R442 VDD N389 100k
J§IR_J467 VDD N389 P530 DR
R§IR_R443 P530 N400 1k
R§IR_R444 N400 VSS 4.8k
J§IR_J468 P529 V0 0 DR
J§IR_J469 N394 N400 0 DR
R§IR_R445 VDD N394 50k
J§IR_J470 VDD N394 P531 DR
R§IR_R446 P531 S8 1k
R§IR_R447 S8 VSS 4.5k
J§IR_J471 N408 U2 P532 DR
R§IR_R448 VDD N408 100k
J§IR_J472 VDD N408 P533 DR
R§IR_R449 P533 N418 1k
R§IR_R450 N418 VSS 4.8k
J§IR_J473 P532 V1 0 DR
J§IR_J474 N413 N418 0 DR
R§IR_R451 VDD N413 50k
J§IR_J475 VDD N413 P534 DR
R§IR_R452 P534 S9 1k
R§IR_R453 S9 VSS 4.5k
J§IR_J476 N424 U2 P535 DR
R§IR_R454 VDD N424 100k
J§IR_J477 VDD N424 P536 DR
R§IR_R455 P536 N434 1k
R§IR_R456 N434 VSS 4.8k
J§IR_J478 P535 V2 0 DR
J§IR_J479 N429 N434 0 DR
R§IR_R457 VDD N429 50k
J§IR_J480 VDD N429 P537 DR
R§IR_R458 P537 S10 1k
R§IR_R459 S10 VSS 4.5k
J§IR_J481 N438 U2 P538 DR
R§IR_R460 VDD N438 100k
J§IR_J482 VDD N438 P539 DR
R§IR_R461 P539 N448 1k
R§IR_R462 N448 VSS 4.8k
J§IR_J483 P538 V3 0 DR
J§IR_J484 N443 N448 0 DR
R§IR_R463 VDD N443 50k
J§IR_J485 VDD N443 P540 DR
R§IR_R464 P540 S11 1k
R§IR_R465 S11 VSS 4.5k
J§IR_J486 N390 U3 P541 DR